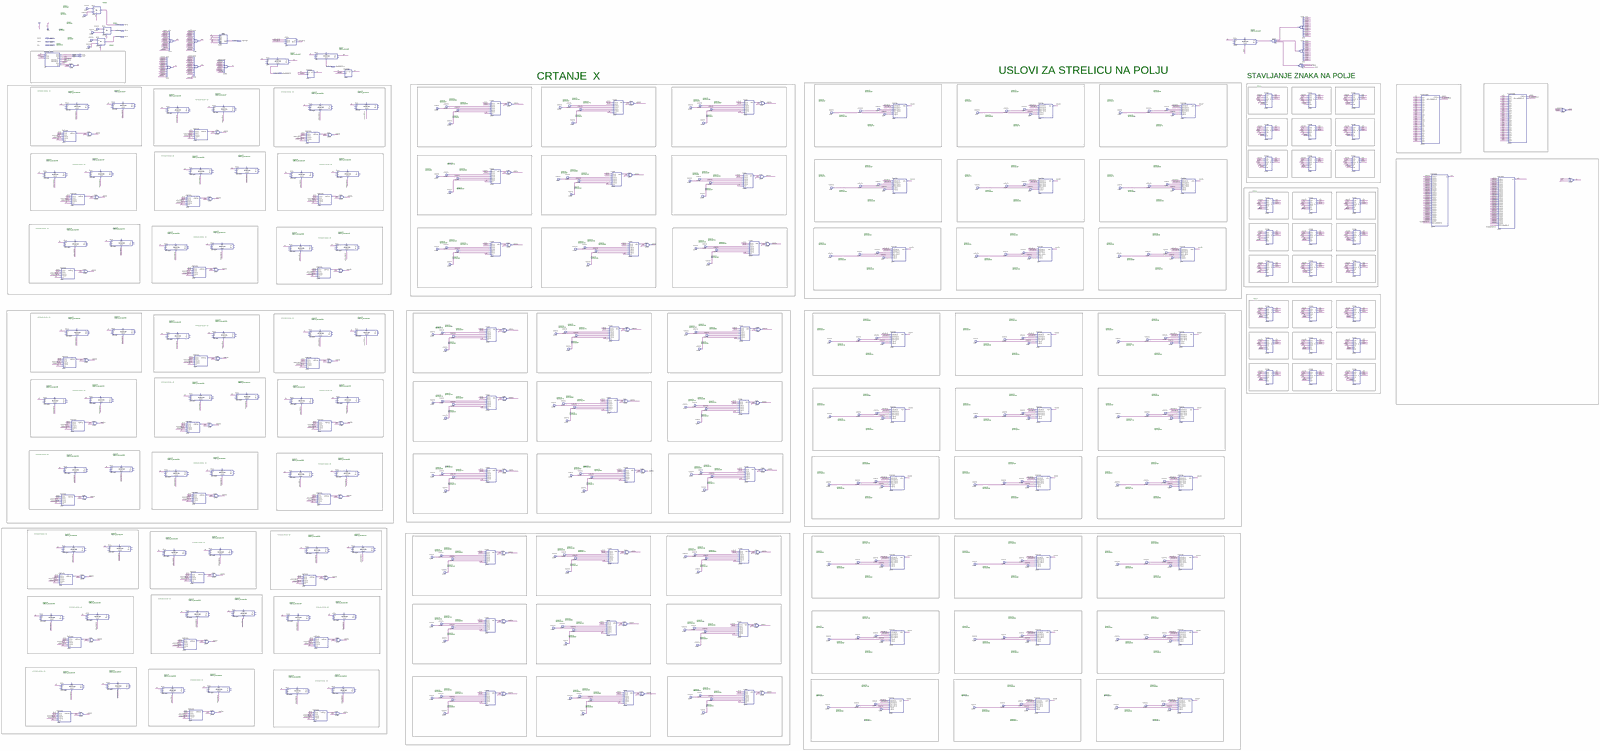
[diagram p0: schematic sheet, whole]
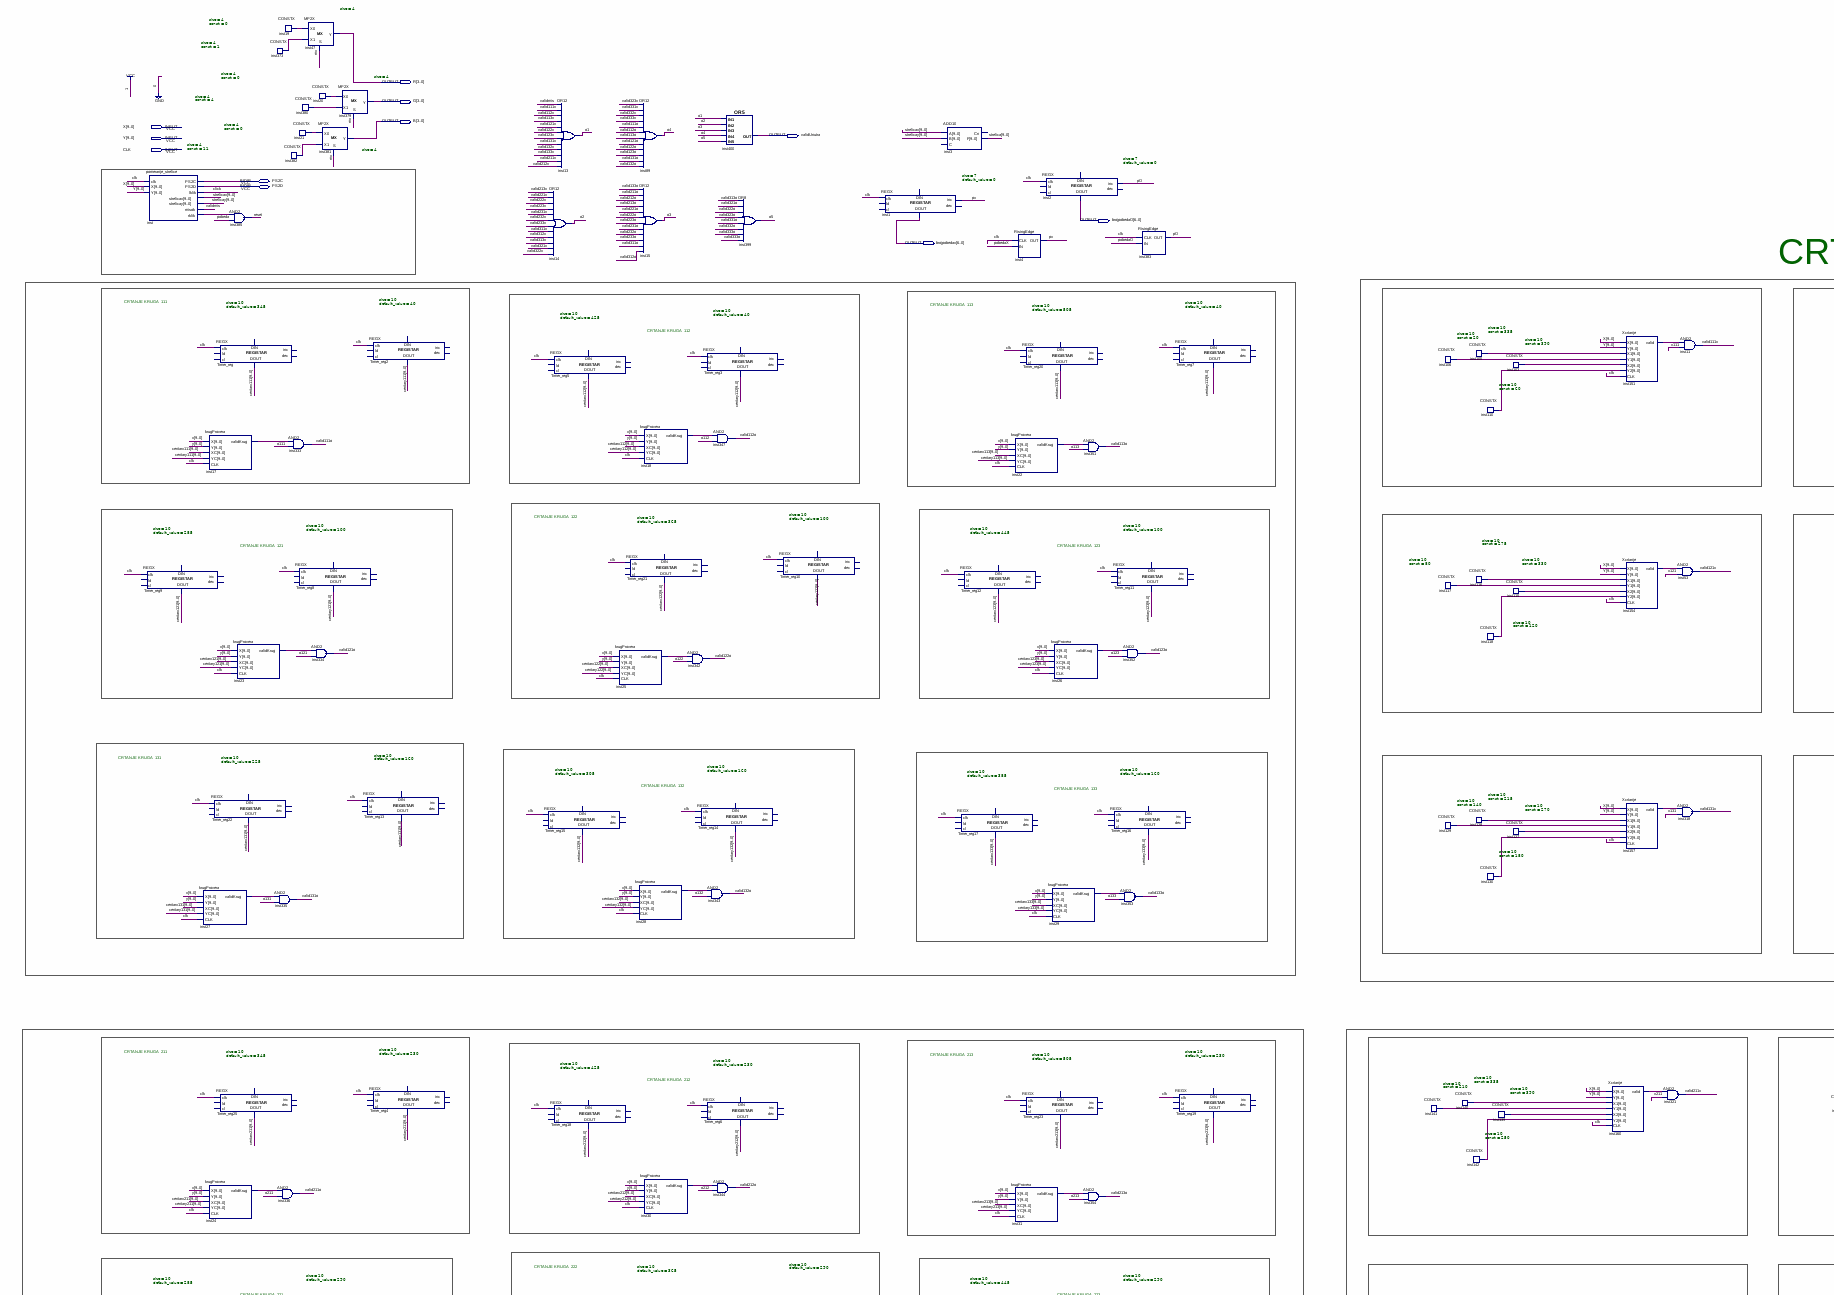
[diagram p1: schematic sheet, upper left part]
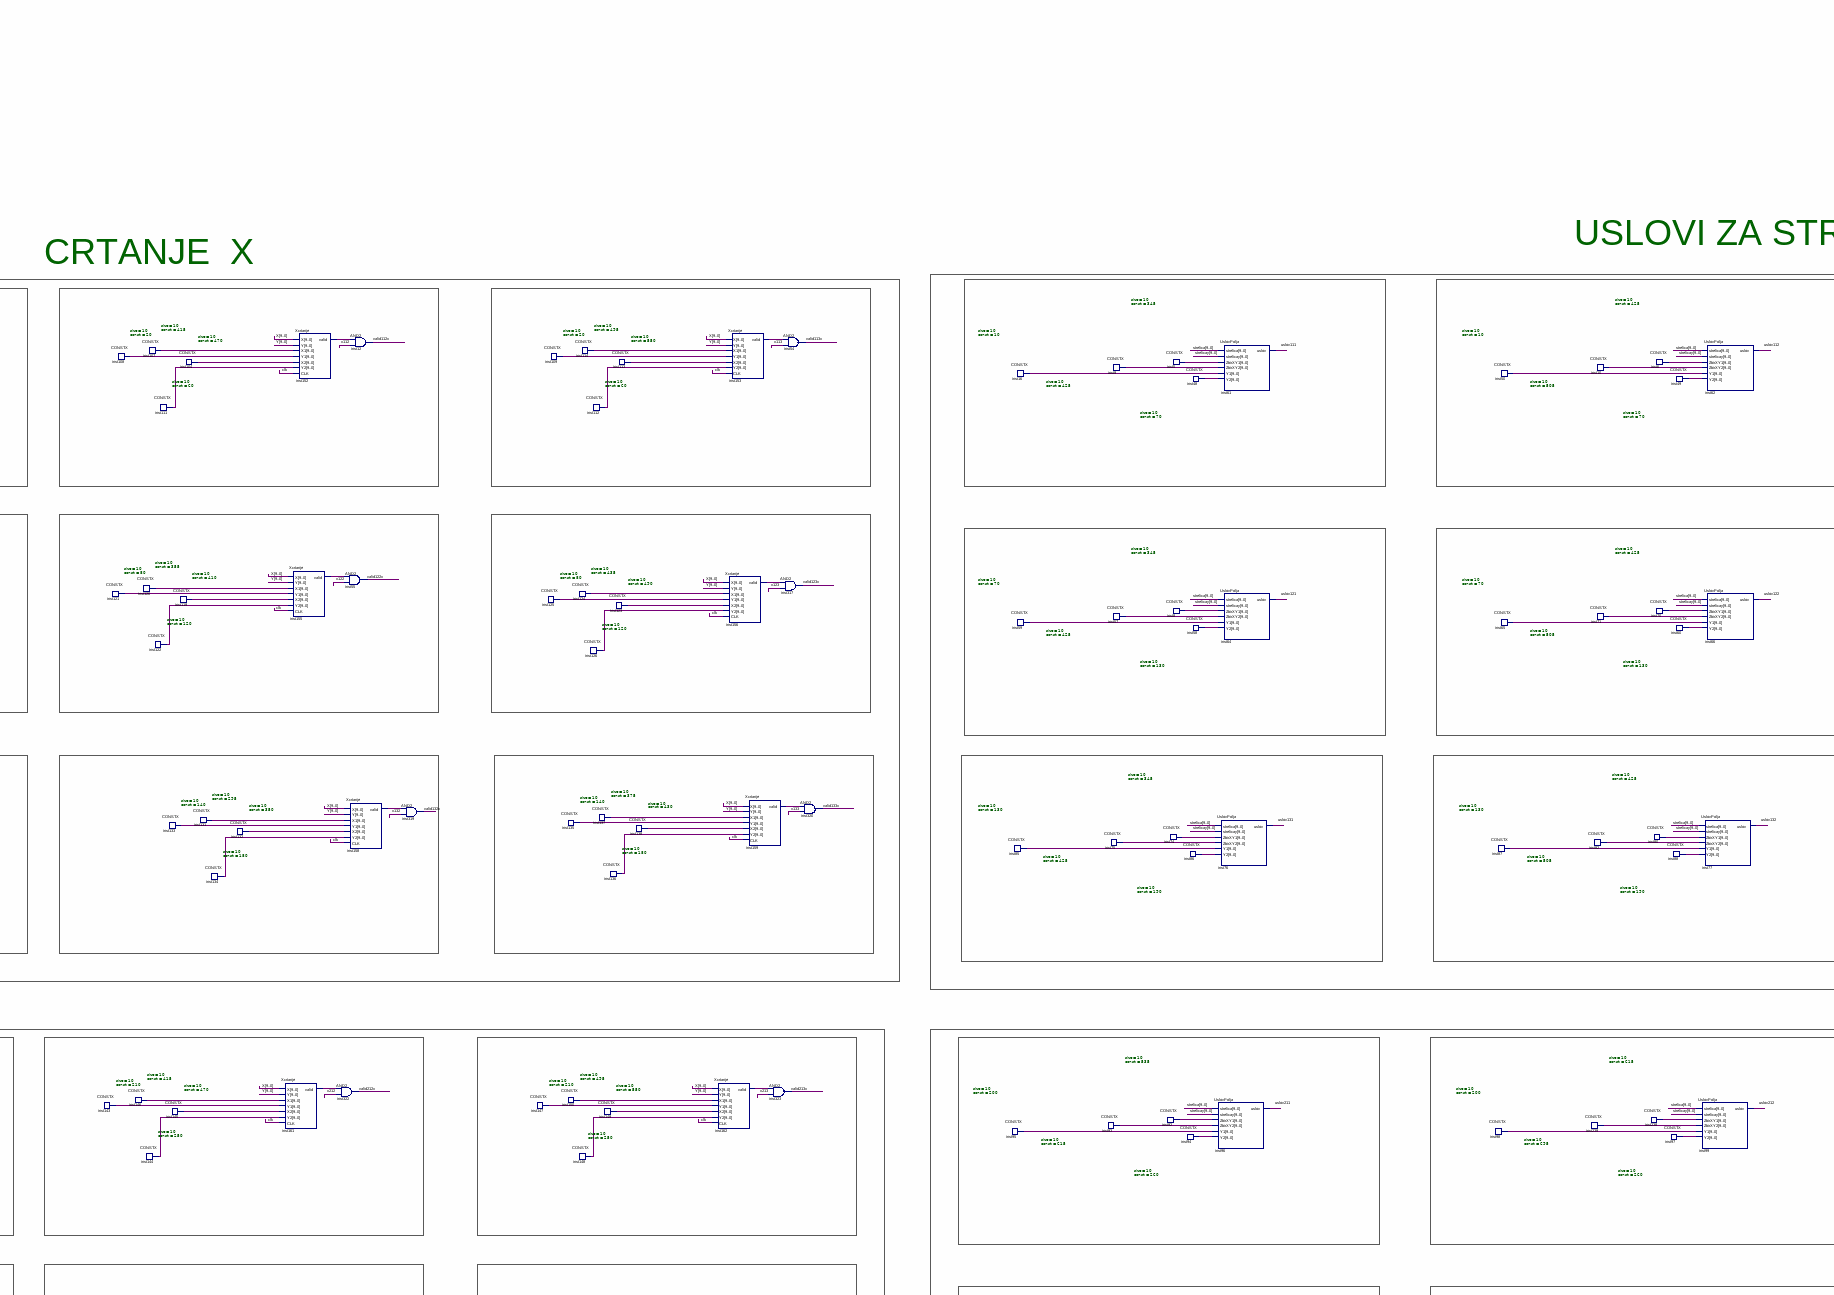
[diagram p2: schematic sheet, upper centre part]
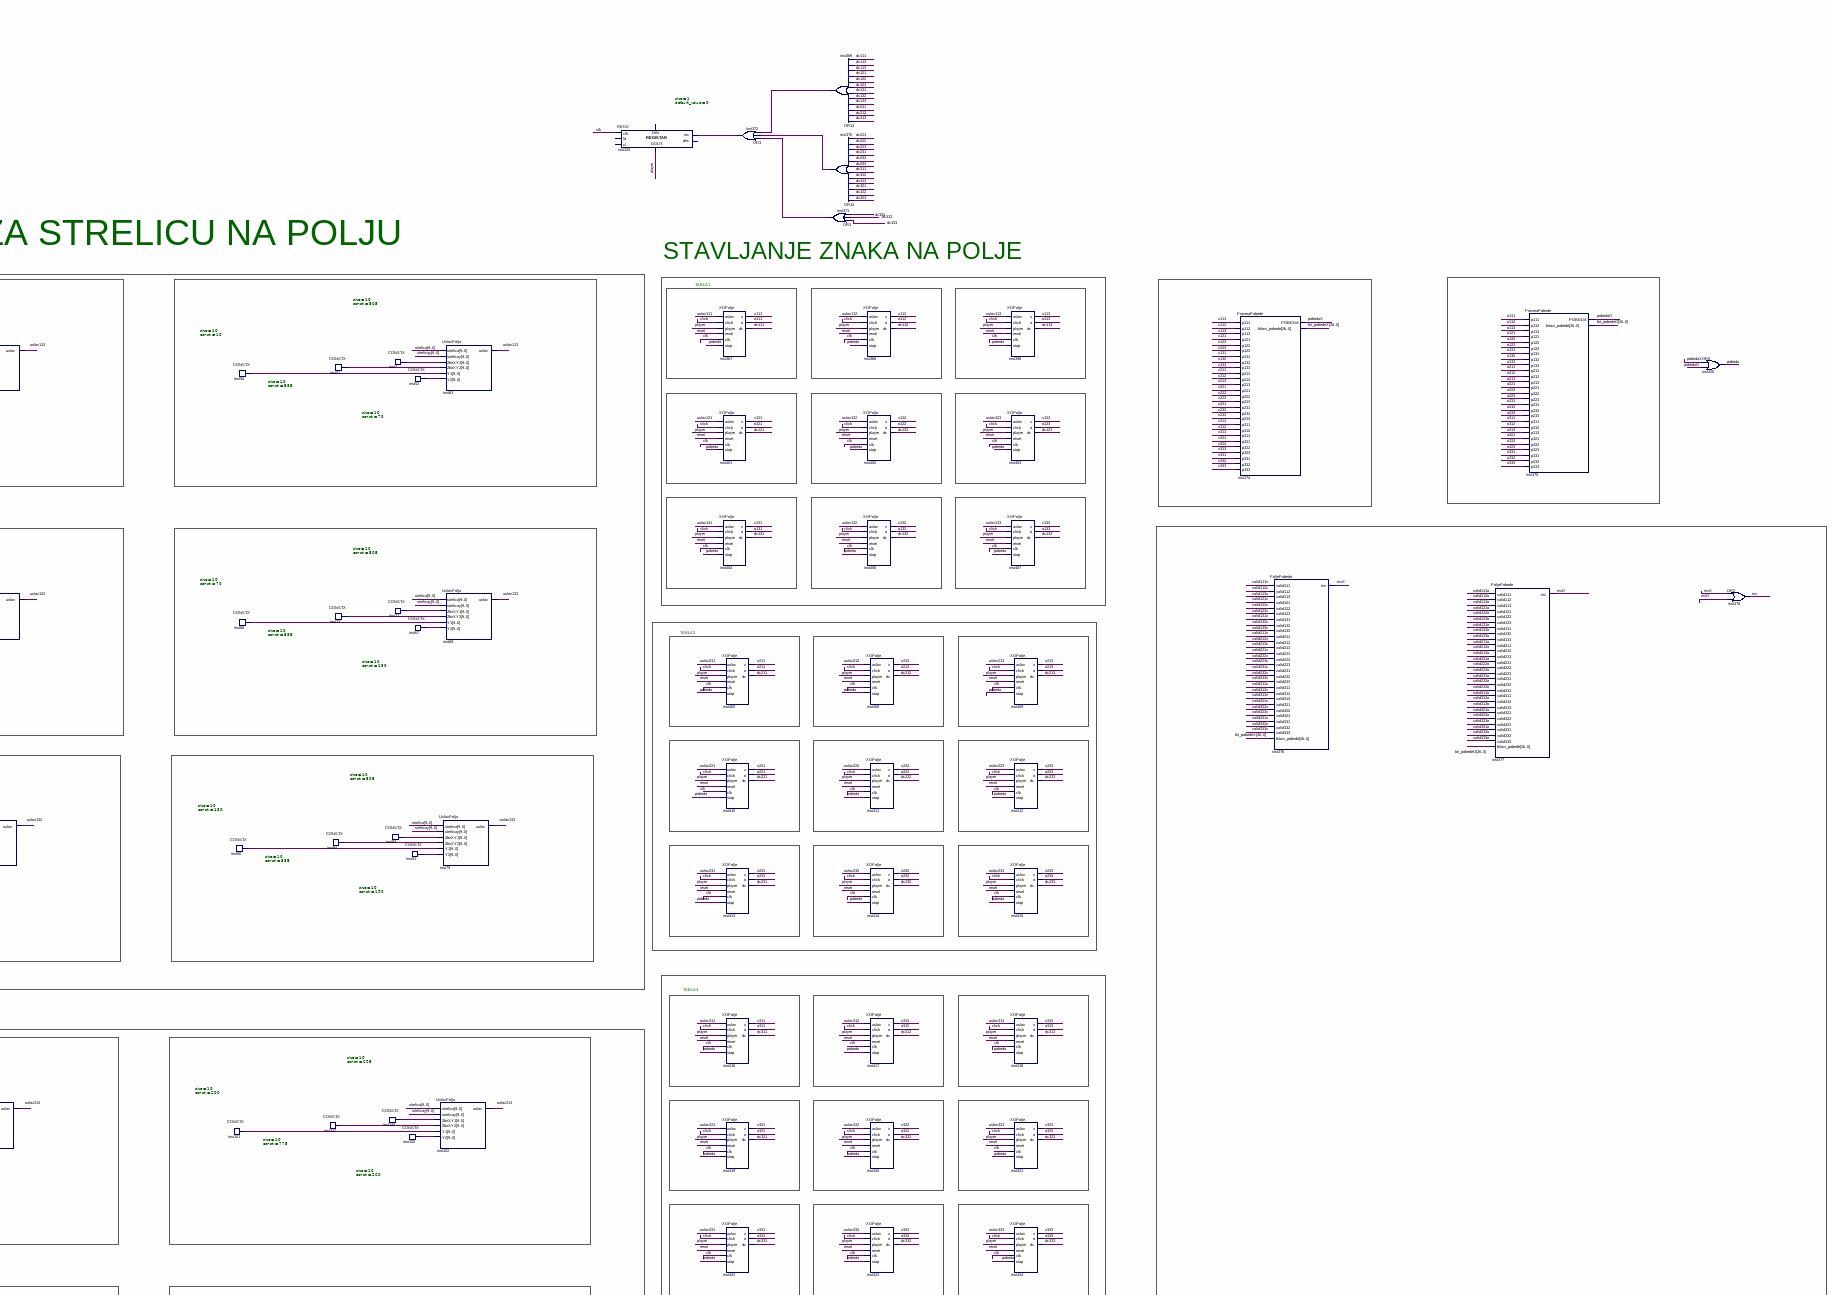
[diagram p3: schematic sheet, upper right part]
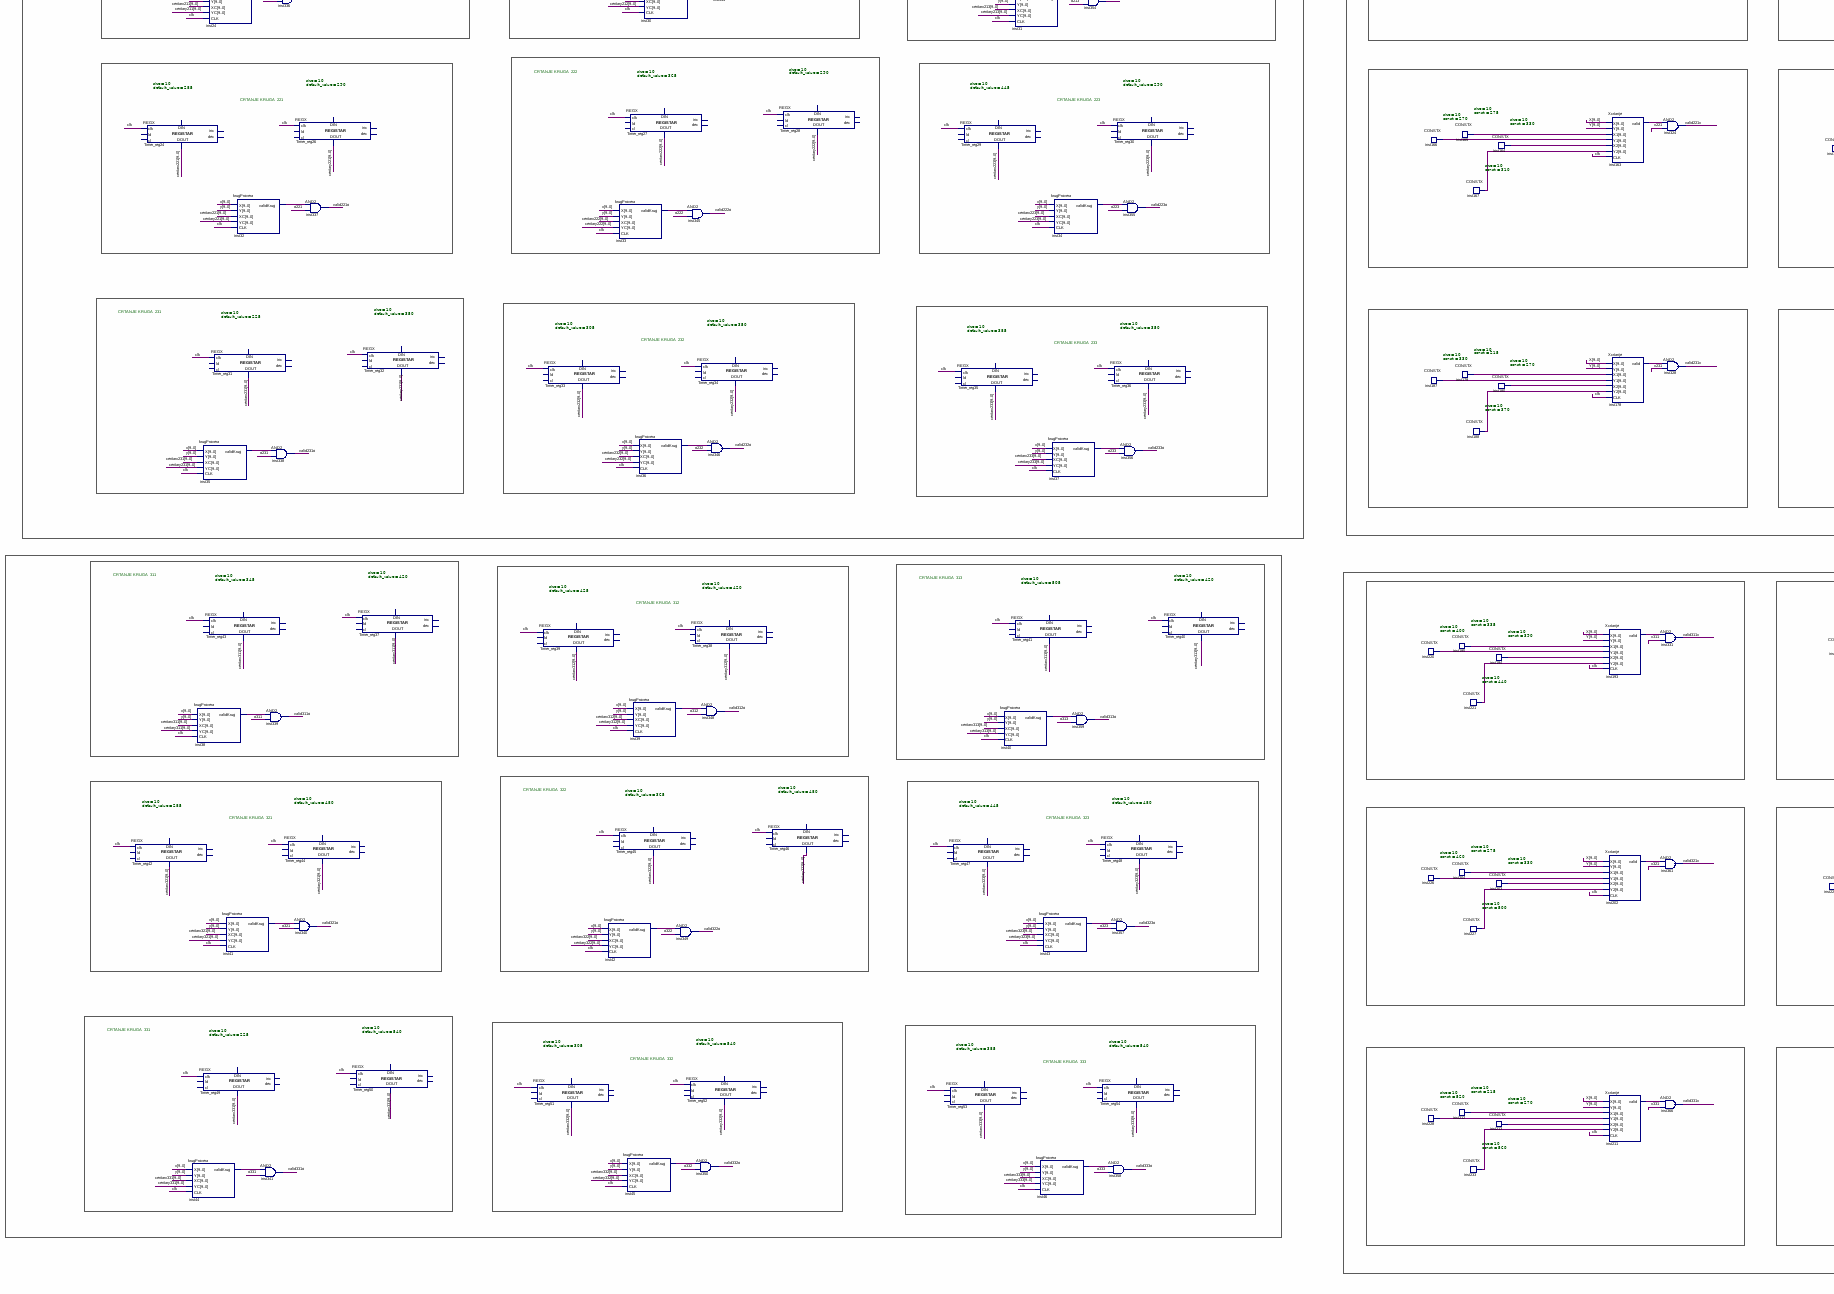
[diagram p4: schematic sheet, lower left part]
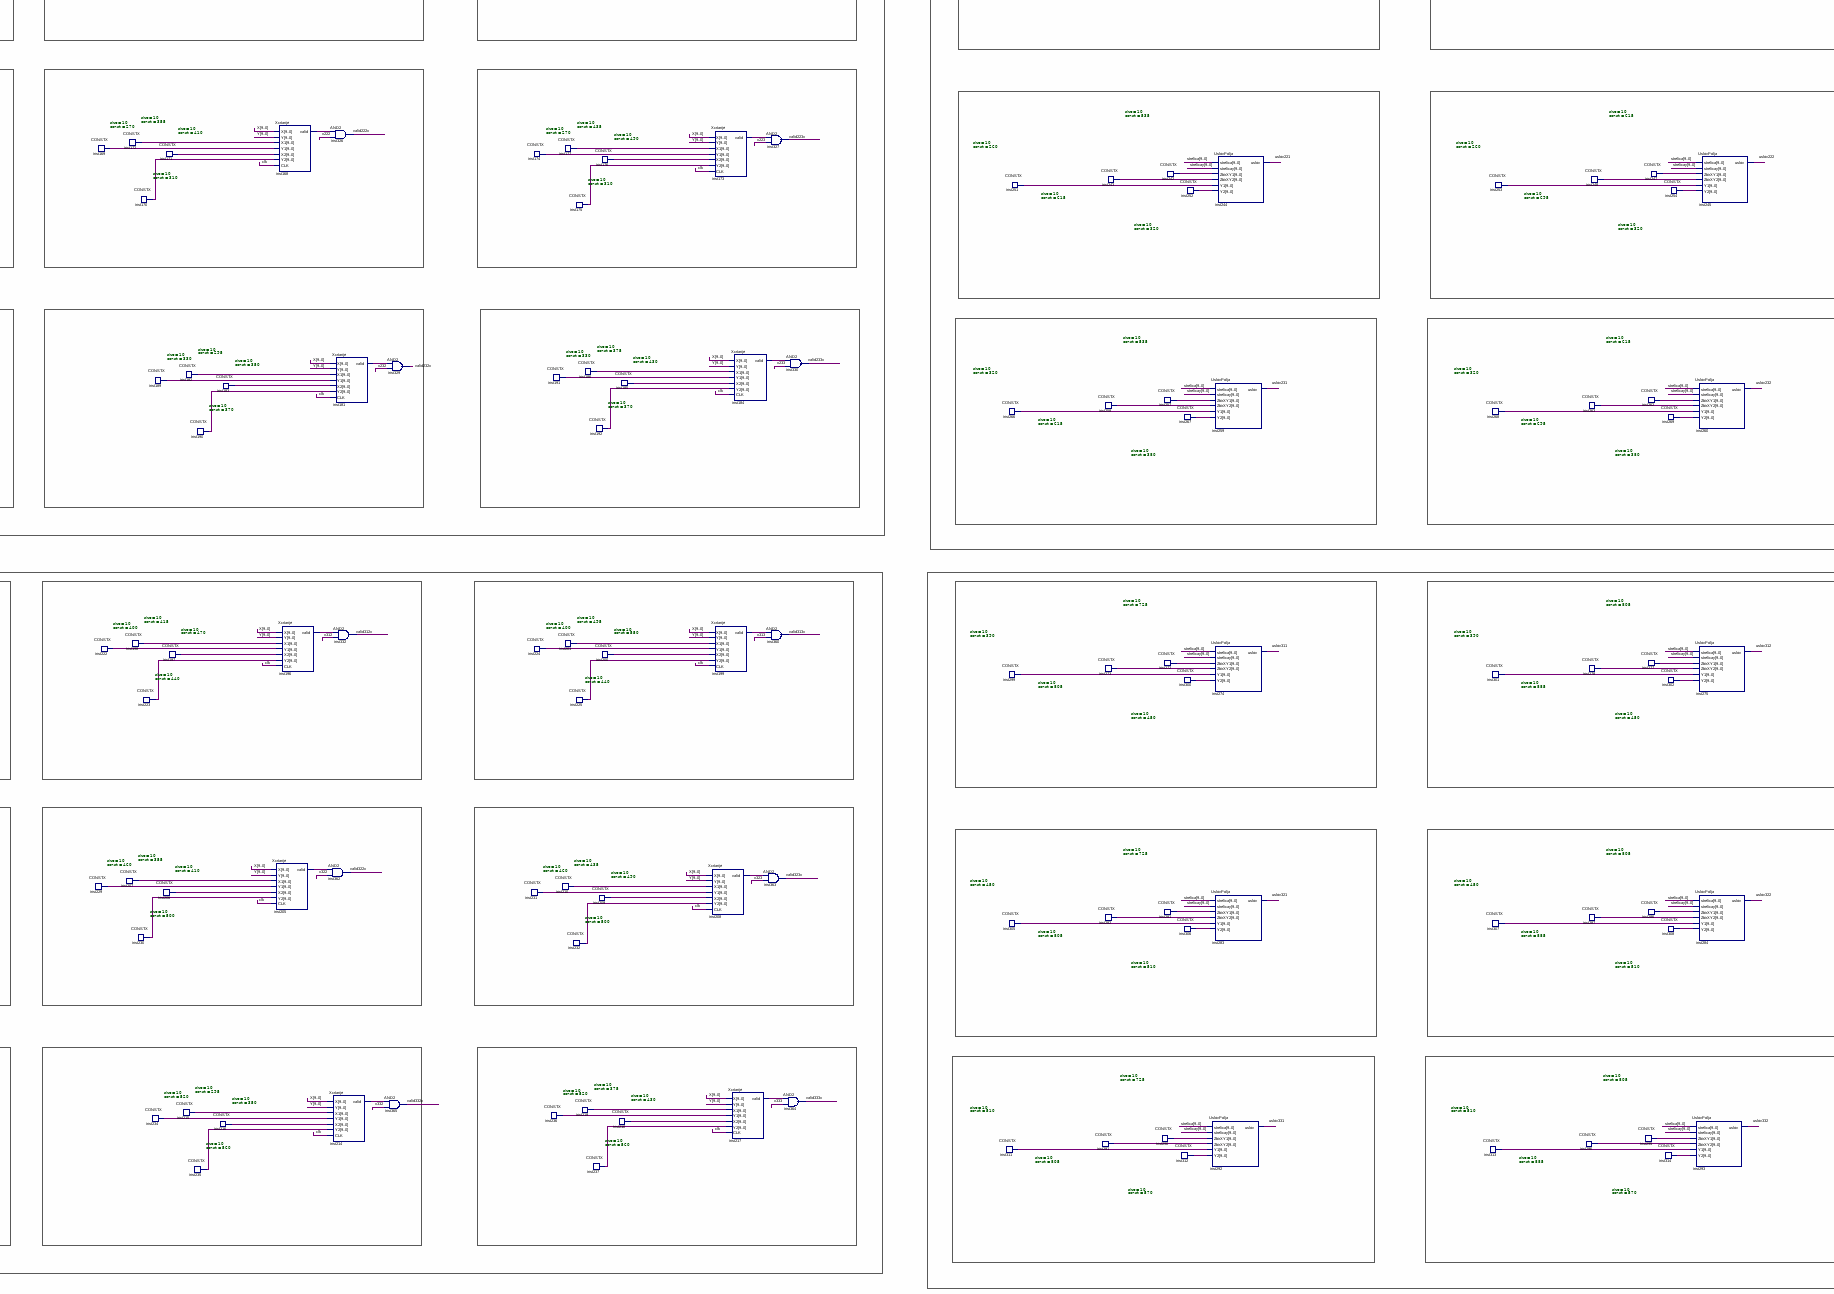
[diagram p5: schematic sheet, lower centre part]
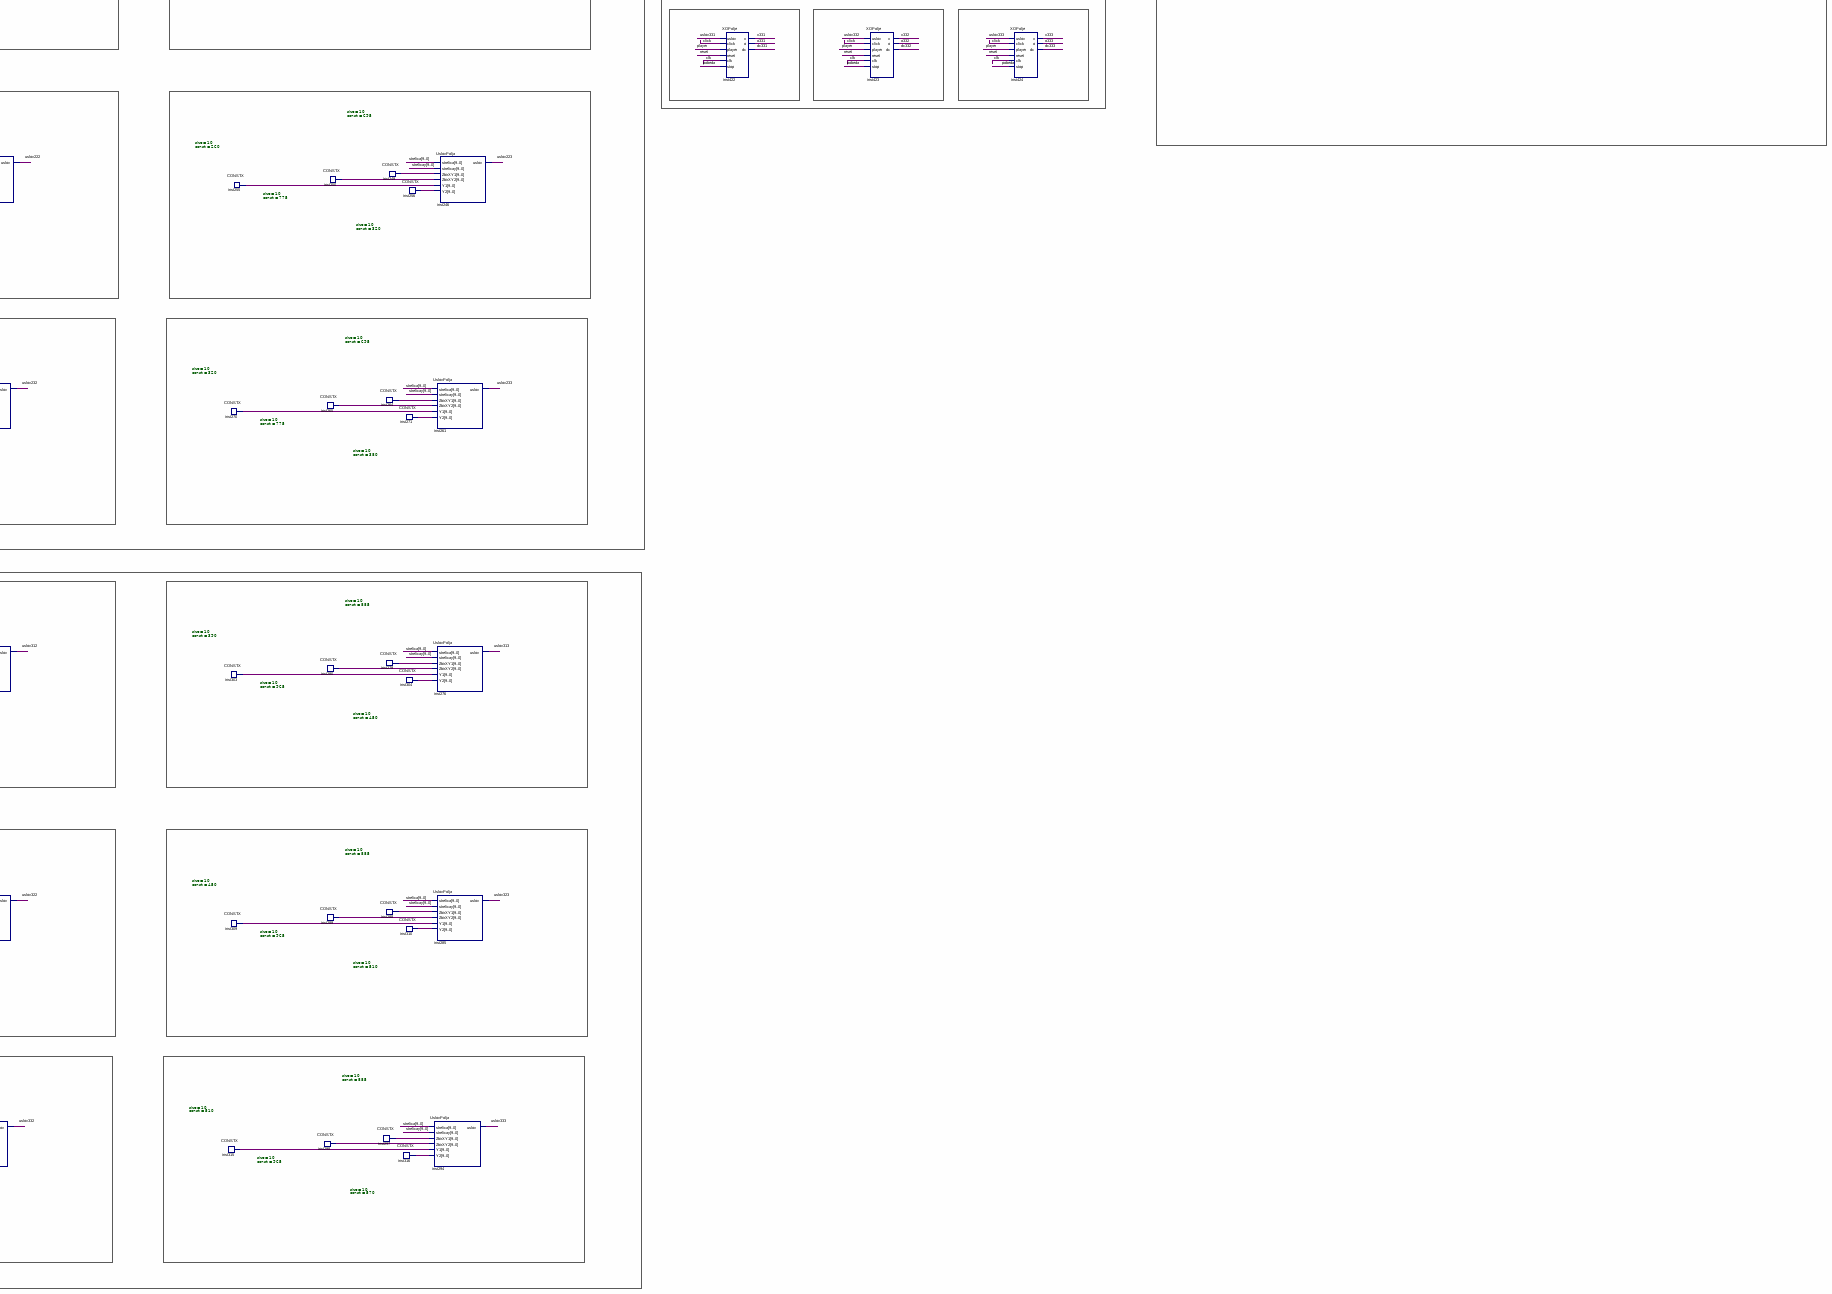
[diagram p6: schematic sheet, lower right part]
// Quartus schematic igra.bdf as structural Verilog: 465 symbols, 11 pins
module igra (
  input  [9:0] X,
  input  [9:0] Y,
  input  CLK,
  inout  PS2C,
  inout  PS2D,
  output [3:0] R,
  output [3:0] G,
  output [3:0] B,
  output validUnutra,
  output [6:0] brojpobedaO,
  output [6:0] brojpobedax
);

  wire click, dc111, dc112, dc113, dc121, dc122, dc123, dc131, dc132, dc133, dc211, dc212, dc213, dc221,
       dc222, dc223, dc231, dc232, dc233, dc311, dc312, dc313, dc321, dc322, dc323, dc331, dc332, dc333,
       inst17_validkrug, inst18_validkrug, inst22_validkrug, inst23_validkrug, inst24_validkrug,
       inst25_validkrug, inst26_validkrug, inst27_validkrug, inst28_validkrug, inst29_validkrug,
       inst30_validkrug, inst31_validkrug, inst32_validkrug, inst33_validkrug, inst34_validkrug,
       inst35_validkrug, inst36_validkrug, inst37_validkrug, inst38_validkrug, inst39_validkrug,
       inst40_validkrug, inst41_validkrug, inst42_validkrug, inst43_validkrug, inst44_validkrug,
       inst45_validkrug, inst46_validkrug, inst151_valid, inst152_valid, inst153_valid, inst154_valid,
       inst155_valid, inst156_valid, inst157_valid, inst158_valid, inst159_valid, inst160_valid,
       inst161_valid, inst162_valid, inst163_valid, inst168_valid, inst173_valid, inst178_valid,
       inst181_valid, inst184_valid, inst193_valid, inst196_valid, inst199_valid, inst202_valid,
       inst205_valid, inst208_valid, inst211_valid, inst214_valid, inst217_valid, inst369_out, inst370_out,
       inst371_out, inst372_out, inst_rklik, mx, mxO, mxX, o1, o2, o3, o4, o5, o111, o112, o113, o121, o122,
       o123, o131, o132, o133, o211, o212, o213, o221, o222, o223, o231, o232, o233, o311, o312, o313, o321,
       o322, o323, o331, o332, o333, player, pO, pobeda, pobedaO, pobedaX, px, reset, uslov111, uslov112,
       uslov113, uslov121, uslov122, uslov123, uslov131, uslov132, uslov133, uslov211, uslov212, uslov213,
       uslov221, uslov222, uslov223, uslov231, uslov232, uslov233, uslov311, uslov312, uslov313, uslov321,
       uslov322, uslov323, uslov331, uslov332, uslov333, valid111o, valid111x, valid112o, valid112x,
       valid113o, valid113x, valid121o, valid121x, valid122o, valid122x, valid123o, valid123x, valid131o,
       valid131x, valid132o, valid132x, valid133o, valid133x, valid211o, valid211x, valid212o, valid212x,
       valid213o, valid213x, valid221o, valid221x, valid222o, valid222x, valid223o, valid223x, valid231o,
       valid231x, valid232o, valid232x, valid233o, valid233x, valid311o, valid311x, valid312o, valid312x,
       valid313o, valid313x, valid321o, valid321x, valid322o, valid322x, valid323o, valid323x, valid331o,
       valid331x, valid332o, valid332x, valid333o, valid333x, validmis, x111, x112, x113, x121, x122, x123,
       x131, x132, x133, x211, x212, x213, x221, x222, x223, x231, x232, x233, x311, x312, x313, x321, x322,
       x323, x331, x332, x333;
  wire [3:0] inst19_data, inst20_data, inst21_data, inst373_data, inst380_data, inst382_data;
  wire [9:0] centarx111, centarx112, centarx113, centarx121, centarx122, centarx123, centarx131, centarx132,
       centarx133, centarx211, centarx212, centarx213, centarx221, centarx222, centarx223, centarx231,
       centarx232, centarx233, centarx311, centarx312, centarx313, centarx321, centarx322, centarx323,
       centarx331, centarx332, centarx333, centary111, centary112, centary113, centary121, centary122,
       centary123, centary131, centary132, centary133, centary211, centary212, centary213, centary221,
       centary222, centary223, centary231, centary232, centary233, centary311, centary312, centary313,
       centary321, centary322, centary323, centary331, centary332, centary333, inst5_data, inst6_data,
       inst7_data, inst8_data, inst9_data, inst10_data, inst16_data, inst48_data, inst49_data, inst50_data,
       inst51_data, inst52_data, inst56_data, inst57_data, inst58_data, inst59_data, inst60_data,
       inst65_data, inst67_data, inst68_data, inst70_data, inst71_data, inst72_data, inst73_data,
       inst74_data, inst75_data, inst80_data, inst82_data, inst83_data, inst84_data, inst85_data,
       inst86_data, inst87_data, inst88_data, inst90_data, inst91_data, inst92_data, inst93_data,
       inst94_data, inst95_data, inst97_data, inst98_data, inst100_data, inst101_data, inst103_data,
       inst104_data, inst105_data, inst106_data, inst107_data, inst108_data, inst109_data, inst110_data,
       inst111_data, inst112_data, inst113_data, inst114_data, inst115_data, inst116_data, inst117_data,
       inst118_data, inst119_data, inst120_data, inst121_data, inst122_data, inst123_data, inst124_data,
       inst125_data, inst126_data, inst127_data, inst128_data, inst129_data, inst130_data, inst131_data,
       inst132_data, inst133_data, inst134_data, inst135_data, inst136_data, inst137_data, inst138_data,
       inst139_data, inst140_data, inst141_data, inst142_data, inst143_data, inst144_data, inst145_data,
       inst146_data, inst147_data, inst148_data, inst149_data, inst150_data, inst164_data, inst165_data,
       inst166_data, inst167_data, inst169_data, inst170_data, inst171_data, inst172_data, inst174_data,
       inst175_data, inst176_data, inst177_data, inst179_data, inst180_data, inst182_data, inst183_data,
       inst185_data, inst186_data, inst187_data, inst188_data, inst189_data, inst190_data, inst191_data,
       inst192_data, inst194_data, inst195_data, inst197_data, inst198_data, inst200_data, inst201_data,
       inst203_data, inst204_data, inst206_data, inst207_data, inst209_data, inst210_data, inst212_data,
       inst213_data, inst215_data, inst216_data, inst218_data, inst219_data, inst220_data, inst221_data,
       inst222_data, inst223_data, inst224_data, inst225_data, inst226_data, inst227_data, inst228_data,
       inst229_data, inst230_data, inst231_data, inst232_data, inst233_data, inst234_data, inst235_data,
       inst236_data, inst237_data, inst238_data, inst239_data, inst240_data, inst241_data, inst242_data,
       inst243_data, inst247_data, inst248_data, inst249_data, inst250_data, inst251_data, inst252_data,
       inst253_data, inst254_data, inst255_data, inst256_data, inst257_data, inst258_data, inst262_data,
       inst263_data, inst264_data, inst265_data, inst266_data, inst267_data, inst268_data, inst269_data,
       inst270_data, inst271_data, inst272_data, inst273_data, inst277_data, inst278_data, inst279_data,
       inst280_data, inst281_data, inst282_data, inst286_data, inst287_data, inst288_data, inst289_data,
       inst290_data, inst291_data, inst295_data, inst296_data, inst297_data, inst298_data, inst299_data,
       inst300_data, inst301_data, inst302_data, inst303_data, inst304_data, inst305_data, inst306_data,
       inst307_data, inst308_data, inst309_data, inst310_data, inst311_data, inst312_data, inst313_data,
       inst314_data, inst315_data, inst316_data, strelica, strelicax, strelicay;
  wire [26:0] bit_pobedeO, bit_pobedeX;

  REGX #(.size(10), .default_value(285)) Timer_reg9 (
    .clk(CLK), .data_out(centarx121));  // open: ld, cl, inc, dec, data_in
  REGX #(.size(10), .default_value(285)) Timer_reg24 (
    .clk(CLK), .data_out(centarx221));  // open: ld, cl, inc, dec, data_in
  REGX #(.size(10), .default_value(285)) Timer_reg42 (
    .clk(CLK), .data_out(centarx321));  // open: ld, cl, inc, dec, data_in
  pomeranje_strelice inst (
    .clk(CLK), .X(X), .Y(Y), .lklik(click), .strelicax(strelicax), .strelicay(strelicay), .misok(validmis),
    .rklik(inst_rklik), .PS2C(PS2C), .PS2D(PS2D));
  krugProvera inst44 (.X(X), .Y(Y), .XC(centarx331), .YC(centary331), .CLK(CLK), .validKrug(inst44_validkrug));
  krugProvera inst17 (.X(X), .Y(Y), .XC(centarx111), .YC(centary111), .CLK(CLK), .validKrug(inst17_validkrug));
  REGX #(.size(10), .default_value(225)) Timer_reg22 (
    .clk(CLK), .data_out(centarx131));  // open: ld, cl, inc, dec, data_in
  krugProvera inst27 (.X(X), .Y(Y), .XC(centarx131), .YC(centary131), .CLK(CLK), .validKrug(inst27_validkrug));
  krugProvera inst24 (.X(X), .Y(Y), .XC(centarx211), .YC(centary211), .CLK(CLK), .validKrug(inst24_validkrug));
  REGX #(.size(10), .default_value(225)) Timer_reg31 (
    .clk(CLK), .data_out(centarx231));  // open: ld, cl, inc, dec, data_in
  krugProvera inst35 (.X(X), .Y(Y), .XC(centarx231), .YC(centary231), .CLK(CLK), .validKrug(inst35_validkrug));
  REGX #(.size(10), .default_value(345)) Timer_reg43 (
    .clk(CLK), .data_out(centarx311));  // open: ld, cl, inc, dec, data_in
  krugProvera inst38 (.X(X), .Y(Y), .XC(centarx311), .YC(centary311), .CLK(CLK), .validKrug(inst38_validkrug));
  REGX #(.size(10), .default_value(225)) Timer_reg49 (
    .clk(CLK), .data_out(centarx331));  // open: ld, cl, inc, dec, data_in
  and inst385 (reset, inst_rklik, pobeda);
  REGX #(.size(10), .default_value(345)) Timer_reg (
    .clk(CLK), .data_out(centarx111));  // open: ld, cl, inc, dec, data_in
  krugProvera inst23 (.X(X), .Y(Y), .XC(centarx121), .YC(centary121), .CLK(CLK), .validKrug(inst23_validkrug));
  REGX #(.size(10), .default_value(345)) Timer_reg25 (
    .clk(CLK), .data_out(centarx211));  // open: ld, cl, inc, dec, data_in
  krugProvera inst32 (.X(X), .Y(Y), .XC(centarx221), .YC(centary221), .CLK(CLK), .validKrug(inst32_validkrug));
  krugProvera inst41 (.X(X), .Y(Y), .XC(centarx321), .YC(centary321), .CLK(CLK), .validKrug(inst41_validkrug));
  CONSTX #(.size(4), .\const (0)) inst19 (.data(inst19_data));
  CONSTX #(.size(4), .\const (1)) inst373 (.data(inst373_data));
  and inst335 (valid131o, inst27_validkrug, o131);
  and inst336 (valid211o, inst24_validkrug, o211);
  and inst338 (valid231o, inst35_validkrug, o231);
  and inst339 (valid311o, inst38_validkrug, o311);
  and inst341 (valid331o, inst44_validkrug, o331);
  CONSTX #(.size(4), .\const (4)) inst380 (.data(inst380_data));
  CONSTX #(.size(4), .\const (0)) inst21 (.data(inst21_data));
  CONSTX #(.size(4), .\const (11)) inst382 (.data(inst382_data));
  and inst333 (valid111o, inst17_validkrug, o111);
  REGX #(.size(10), .default_value(100)) Timer_reg8 (
    .clk(CLK), .data_out(centary121));  // open: ld, cl, inc, dec, data_in
  REGX #(.size(10), .default_value(290)) Timer_reg26 (
    .clk(CLK), .data_out(centary221));  // open: ld, cl, inc, dec, data_in
  REGX #(.size(10), .default_value(480)) Timer_reg44 (
    .clk(CLK), .data_out(centary321));  // open: ld, cl, inc, dec, data_in
  and inst340 (valid321o, inst41_validkrug, o321);
  MP2X #(.size(4)) inst47 (.S(mx), .X0(inst19_data), .X1(inst373_data), .Y(R));
  CONSTX #(.size(4), .\const (0)) inst20 (.data(inst20_data));
  MP2X #(.size(4)) inst381 (.S(mx), .X0(inst21_data), .X1(inst382_data), .Y(B));
  and inst334 (valid121o, inst23_validkrug, o121);
  and inst337 (valid221o, inst32_validkrug, o221);
  MP2X #(.size(4)) inst379 (.S(mx), .X0(inst20_data), .X1(inst380_data), .Y(G));
  REGX #(.size(10), .default_value(40)) Timer_reg2 (
    .clk(CLK), .data_out(centary111));  // open: ld, cl, inc, dec, data_in
  REGX #(.size(10), .default_value(160)) Timer_reg13 (
    .clk(CLK), .data_out(centary131));  // open: ld, cl, inc, dec, data_in
  REGX #(.size(10), .default_value(230)) Timer_reg4 (
    .clk(CLK), .data_out(centary211));  // open: ld, cl, inc, dec, data_in
  REGX #(.size(10), .default_value(350)) Timer_reg32 (
    .clk(CLK), .data_out(centary231));  // open: ld, cl, inc, dec, data_in
  REGX #(.size(10), .default_value(420)) Timer_reg37 (
    .clk(CLK), .data_out(centary311));  // open: ld, cl, inc, dec, data_in
  REGX #(.size(10), .default_value(540)) Timer_reg50 (
    .clk(CLK), .data_out(centary331));  // open: ld, cl, inc, dec, data_in
  or inst14 (o2, valid213x, valid221x, valid222x, valid223x, valid231x, valid232x, valid233x, valid311x, valid312x, valid313x, valid321x, valid322x);
  REGX #(.size(10), .default_value(425)) Timer_reg5 (
    .clk(CLK), .data_out(centarx112));  // open: ld, cl, inc, dec, data_in
  REGX #(.size(10), .default_value(305)) Timer_reg15 (
    .clk(CLK), .data_out(centarx132));  // open: ld, cl, inc, dec, data_in
  REGX #(.size(10), .default_value(425)) Timer_reg18 (
    .clk(CLK), .data_out(centarx212));  // open: ld, cl, inc, dec, data_in
  REGX #(.size(10), .default_value(305)) Timer_reg33 (
    .clk(CLK), .data_out(centarx232));  // open: ld, cl, inc, dec, data_in
  REGX #(.size(10), .default_value(425)) Timer_reg39 (
    .clk(CLK), .data_out(centarx312));  // open: ld, cl, inc, dec, data_in
  REGX #(.size(10), .default_value(305)) Timer_reg51 (
    .clk(CLK), .data_out(centarx332));  // open: ld, cl, inc, dec, data_in
  or inst13 (o1, validmis, valid111x, valid112x, valid113x, valid121x, valid122x, valid123x, valid131x, valid132x, valid133x, valid211x, valid212x);
  krugProvera inst25 (.X(X), .Y(Y), .XC(centarx122), .YC(centary122), .CLK(CLK), .validKrug(inst25_validkrug));
  krugProvera inst33 (.X(X), .Y(Y), .XC(centarx222), .YC(centary222), .CLK(CLK), .validKrug(inst33_validkrug));
  REGX #(.size(10), .default_value(365)) Timer_reg45 (
    .clk(CLK), .data_out(centarx322));  // open: ld, cl, inc, dec, data_in
  krugProvera inst42 (.X(X), .Y(Y), .XC(centarx322), .YC(centary322), .CLK(CLK), .validKrug(inst42_validkrug));
  or inst89 (o4, valid323x, valid331x, valid332x, valid333x, valid111o, valid112o, valid113o, valid121o, valid122o, valid123o, valid131o, valid132o);
  or inst15 (o3, valid133o, valid211o, valid212o, valid213o, valid221o, valid222o, valid223o, valid231o, valid232o, valid233o, valid311o, valid312o);
  krugProvera inst18 (.X(X), .Y(Y), .XC(centarx112), .YC(centary112), .CLK(CLK), .validKrug(inst18_validkrug));
  REGX #(.size(10), .default_value(365)) Timer_reg21 (
    .clk(CLK), .data_out(centarx122));  // open: ld, cl, inc, dec, data_in
  krugProvera inst28 (.X(X), .Y(Y), .XC(centarx132), .YC(centary132), .CLK(CLK), .validKrug(inst28_validkrug));
  krugProvera inst30 (.X(X), .Y(Y), .XC(centarx212), .YC(centary212), .CLK(CLK), .validKrug(inst30_validkrug));
  REGX #(.size(10), .default_value(365)) Timer_reg27 (
    .clk(CLK), .data_out(centarx222));  // open: ld, cl, inc, dec, data_in
  krugProvera inst36 (.X(X), .Y(Y), .XC(centarx232), .YC(centary232), .CLK(CLK), .validKrug(inst36_validkrug));
  krugProvera inst39 (.X(X), .Y(Y), .XC(centarx312), .YC(centary312), .CLK(CLK), .validKrug(inst39_validkrug));
  krugProvera inst45 (.X(X), .Y(Y), .XC(centarx332), .YC(centary332), .CLK(CLK), .validKrug(inst45_validkrug));
  and inst349 (valid322o, inst42_validkrug, o322);
  REGX #(.size(10), .default_value(540)) Timer_reg52 (
    .clk(CLK), .data_out(centary332));  // open: ld, cl, inc, dec, data_in
  REGX #(.size(10), .default_value(40)) Timer_reg3 (
    .clk(CLK), .data_out(centary112));  // open: ld, cl, inc, dec, data_in
  and inst342 (valid122o, inst25_validkrug, o122);
  REGX #(.size(10), .default_value(160)) Timer_reg14 (
    .clk(CLK), .data_out(centary132));  // open: ld, cl, inc, dec, data_in
  and inst343 (valid132o, inst28_validkrug, o132);
  REGX #(.size(10), .default_value(230)) Timer_reg6 (
    .clk(CLK), .data_out(centary212));  // open: ld, cl, inc, dec, data_in
  and inst345 (valid222o, inst33_validkrug, o222);
  REGX #(.size(10), .default_value(350)) Timer_reg34 (
    .clk(CLK), .data_out(centary232));  // open: ld, cl, inc, dec, data_in
  and inst346 (valid232o, inst36_validkrug, o232);
  REGX #(.size(10), .default_value(420)) Timer_reg38 (
    .clk(CLK), .data_out(centary312));  // open: ld, cl, inc, dec, data_in
  and inst348 (valid312o, inst39_validkrug, o312);
  and inst350 (valid332o, inst45_validkrug, o332);
  or inst400 (validUnutra, o1, o2, o3, o4, o5);
  and inst347 (valid112o, inst18_validkrug, o112);
  and inst344 (valid212o, inst30_validkrug, o212);
  or inst399 (o5, valid313o, valid321o, valid322o, valid323o, valid331o, valid332o, valid333o, valid333o);
  REGX #(.size(10), .default_value(480)) Timer_reg46 (
    .clk(CLK), .data_out(centary322));  // open: ld, cl, inc, dec, data_in
  REGX #(.size(10), .default_value(100)) Timer_reg10 (
    .clk(CLK), .data_out(centary122));  // open: ld, cl, inc, dec, data_in
  REGX #(.size(10), .default_value(290)) Timer_reg28 (
    .clk(CLK), .data_out(centary222));  // open: ld, cl, inc, dec, data_in
  REGX #(.size(7), .default_value(0)) inst1 (
    .clk(CLK), .inc(px), .data_out(brojpobedax));  // open: ld, cl, dec, data_in
  ADD10 inst3 (.A(strelicax), .B(strelicay), .F(strelica));  // open: C, Cn
  REGX #(.size(10), .default_value(385)) Timer_reg17 (
    .clk(CLK), .data_out(centarx133));  // open: ld, cl, inc, dec, data_in
  REGX #(.size(10), .default_value(385)) Timer_reg35 (
    .clk(CLK), .data_out(centarx233));  // open: ld, cl, inc, dec, data_in
  REGX #(.size(10), .default_value(445)) Timer_reg47 (
    .clk(CLK), .data_out(centarx323));  // open: ld, cl, inc, dec, data_in
  REGX #(.size(10), .default_value(385)) Timer_reg53 (
    .clk(CLK), .data_out(centarx333));  // open: ld, cl, inc, dec, data_in
  REGX #(.size(10), .default_value(445)) Timer_reg12 (
    .clk(CLK), .data_out(centarx123));  // open: ld, cl, inc, dec, data_in
  REGX #(.size(10), .default_value(445)) Timer_reg29 (
    .clk(CLK), .data_out(centarx223));  // open: ld, cl, inc, dec, data_in
  krugProvera inst40 (.X(X), .Y(Y), .XC(centarx313), .YC(centary313), .CLK(CLK), .validKrug(inst40_validkrug));
  RisingEdge inst4 (.CLK(CLK), .IN(pobedaX), .OUT(px));
  REGX #(.size(10), .default_value(505)) Timer_reg20 (
    .clk(CLK), .data_out(centarx113));  // open: ld, cl, inc, dec, data_in
  krugProvera inst22 (.X(X), .Y(Y), .XC(centarx113), .YC(centary113), .CLK(CLK), .validKrug(inst22_validkrug));
  REGX #(.size(10), .default_value(505)) Timer_reg23 (
    .clk(CLK), .data_out(centarx213));  // open: ld, cl, inc, dec, data_in
  krugProvera inst31 (.X(X), .Y(Y), .XC(centarx213), .YC(centary213), .CLK(CLK), .validKrug(inst31_validkrug));
  REGX #(.size(10), .default_value(505)) Timer_reg41 (
    .clk(CLK), .data_out(centarx313));  // open: ld, cl, inc, dec, data_in
  REGX #(.size(7), .default_value(0)) inst2 (
    .clk(CLK), .inc(pO), .data_out(brojpobedaO));  // open: ld, cl, dec, data_in
  krugProvera inst29 (.X(X), .Y(Y), .XC(centarx133), .YC(centary133), .CLK(CLK), .validKrug(inst29_validkrug));
  krugProvera inst37 (.X(X), .Y(Y), .XC(centarx233), .YC(centary233), .CLK(CLK), .validKrug(inst37_validkrug));
  krugProvera inst43 (.X(X), .Y(Y), .XC(centarx323), .YC(centary323), .CLK(CLK), .validKrug(inst43_validkrug));
  krugProvera inst46 (.X(X), .Y(Y), .XC(centarx333), .YC(centary333), .CLK(CLK), .validKrug(inst46_validkrug));
  krugProvera inst26 (.X(X), .Y(Y), .XC(centarx123), .YC(centary123), .CLK(CLK), .validKrug(inst26_validkrug));
  krugProvera inst34 (.X(X), .Y(Y), .XC(centarx223), .YC(centary223), .CLK(CLK), .validKrug(inst34_validkrug));
  and inst351 (valid113o, inst22_validkrug, o113);
  and inst354 (valid213o, inst31_validkrug, o213);
  and inst359 (valid313o, inst40_validkrug, o313);
  REGX #(.size(10), .default_value(100)) Timer_reg11 (
    .clk(CLK), .data_out(centary123));  // open: ld, cl, inc, dec, data_in
  REGX #(.size(10), .default_value(160)) Timer_reg16 (
    .clk(CLK), .data_out(centary133));  // open: ld, cl, inc, dec, data_in
  REGX #(.size(10), .default_value(290)) Timer_reg30 (
    .clk(CLK), .data_out(centary223));  // open: ld, cl, inc, dec, data_in
  REGX #(.size(10), .default_value(350)) Timer_reg36 (
    .clk(CLK), .data_out(centary233));  // open: ld, cl, inc, dec, data_in
  REGX #(.size(10), .default_value(480)) Timer_reg48 (
    .clk(CLK), .data_out(centary323));  // open: ld, cl, inc, dec, data_in
  and inst357 (valid323o, inst43_validkrug, o323);
  REGX #(.size(10), .default_value(540)) Timer_reg54 (
    .clk(CLK), .data_out(centary333));  // open: ld, cl, inc, dec, data_in
  and inst358 (valid333o, inst46_validkrug, o333);
  RisingEdge inst383 (.CLK(CLK), .IN(pobedaO), .OUT(pO));
  and inst352 (valid123o, inst26_validkrug, o123);
  and inst353 (valid133o, inst29_validkrug, o133);
  and inst355 (valid223o, inst34_validkrug, o223);
  and inst356 (valid233o, inst37_validkrug, o233);
  REGX #(.size(10), .default_value(40)) Timer_reg7 (
    .clk(CLK), .data_out(centary113));  // open: ld, cl, inc, dec, data_in
  REGX #(.size(10), .default_value(230)) Timer_reg19 (
    .clk(CLK), .data_out(centary213));  // open: ld, cl, inc, dec, data_in
  REGX #(.size(10), .default_value(420)) Timer_reg40 (
    .clk(CLK), .data_out(centary313));  // open: ld, cl, inc, dec, data_in
  CONSTX #(.size(10), .\const (210)) inst141 (.data(inst141_data));
  CONSTX #(.size(10), .\const (270)) inst166 (.data(inst166_data));
  CONSTX #(.size(10), .\const (330)) inst187 (.data(inst187_data));
  CONSTX #(.size(10), .\const (400)) inst220 (.data(inst220_data));
  CONSTX #(.size(10), .\const (460)) inst226 (.data(inst226_data));
  CONSTX #(.size(10), .\const (520)) inst228 (.data(inst228_data));
  CONSTX #(.size(10), .\const (20)) inst106 (.data(inst106_data));
  CONSTX #(.size(10), .\const (80)) inst117 (.data(inst117_data));
  CONSTX #(.size(10), .\const (140)) inst129 (.data(inst129_data));
  CONSTX #(.size(10), .\const (335)) inst140 (.data(inst140_data));
  CONSTX #(.size(10), .\const (275)) inst165 (.data(inst165_data));
  CONSTX #(.size(10), .\const (215)) inst179 (.data(inst179_data));
  CONSTX #(.size(10), .\const (335)) inst195 (.data(inst195_data));
  CONSTX #(.size(10), .\const (275)) inst204 (.data(inst204_data));
  CONSTX #(.size(10), .\const (215)) inst212 (.data(inst212_data));
  CONSTX #(.size(10), .\const (335)) inst105 (.data(inst105_data));
  CONSTX #(.size(10), .\const (275)) inst116 (.data(inst116_data));
  CONSTX #(.size(10), .\const (215)) inst128 (.data(inst128_data));
  CONSTX #(.size(10), .\const (250)) inst142 (.data(inst142_data));
  CONSTX #(.size(10), .\const (310)) inst167 (.data(inst167_data));
  CONSTX #(.size(10), .\const (370)) inst188 (.data(inst188_data));
  CONSTX #(.size(10), .\const (440)) inst221 (.data(inst221_data));
  CONSTX #(.size(10), .\const (500)) inst227 (.data(inst227_data));
  CONSTX #(.size(10), .\const (560)) inst233 (.data(inst233_data));
  CONSTX #(.size(10), .\const (60)) inst110 (.data(inst110_data));
  CONSTX #(.size(10), .\const (120)) inst118 (.data(inst118_data));
  CONSTX #(.size(10), .\const (180)) inst130 (.data(inst130_data));
  CONSTX #(.size(10), .\const (390)) inst139 (.data(inst139_data));
  CONSTX #(.size(10), .\const (330)) inst164 (.data(inst164_data));
  CONSTX #(.size(10), .\const (270)) inst180 (.data(inst180_data));
  CONSTX #(.size(10), .\const (390)) inst194 (.data(inst194_data));
  CONSTX #(.size(10), .\const (330)) inst203 (.data(inst203_data));
  CONSTX #(.size(10), .\const (270)) inst213 (.data(inst213_data));
  CONSTX #(.size(10), .\const (390)) inst103 (.data(inst103_data));
  CONSTX #(.size(10), .\const (330)) inst115 (.data(inst115_data));
  CONSTX #(.size(10), .\const (270)) inst127 (.data(inst127_data));
  Xcrtanje inst160 (
    .X(X), .Y(Y), .X1(inst140_data), .Y1(inst141_data), .X2(inst139_data), .Y2(inst142_data), .CLK(CLK),
    .valid(inst160_valid));
  Xcrtanje inst163 (
    .X(X), .Y(Y), .X1(inst165_data), .Y1(inst166_data), .X2(inst164_data), .Y2(inst167_data), .CLK(CLK),
    .valid(inst163_valid));
  Xcrtanje inst178 (
    .X(X), .Y(Y), .X1(inst179_data), .Y1(inst187_data), .X2(inst180_data), .Y2(inst188_data), .CLK(CLK),
    .valid(inst178_valid));
  Xcrtanje inst193 (
    .X(X), .Y(Y), .X1(inst195_data), .Y1(inst220_data), .X2(inst194_data), .Y2(inst221_data), .CLK(CLK),
    .valid(inst193_valid));
  Xcrtanje inst202 (
    .X(X), .Y(Y), .X1(inst204_data), .Y1(inst226_data), .X2(inst203_data), .Y2(inst227_data), .CLK(CLK),
    .valid(inst202_valid));
  Xcrtanje inst211 (
    .X(X), .Y(Y), .X1(inst212_data), .Y1(inst228_data), .X2(inst213_data), .Y2(inst233_data), .CLK(CLK),
    .valid(inst211_valid));
  Xcrtanje inst151 (
    .X(X), .Y(Y), .X1(inst105_data), .Y1(inst106_data), .X2(inst103_data), .Y2(inst110_data), .CLK(CLK),
    .valid(inst151_valid));
  Xcrtanje inst154 (
    .X(X), .Y(Y), .X1(inst116_data), .Y1(inst117_data), .X2(inst115_data), .Y2(inst118_data), .CLK(CLK),
    .valid(inst154_valid));
  Xcrtanje inst157 (
    .X(X), .Y(Y), .X1(inst128_data), .Y1(inst129_data), .X2(inst127_data), .Y2(inst130_data), .CLK(CLK),
    .valid(inst157_valid));
  and inst11 (valid111x, inst151_valid, x111);
  and inst53 (valid121x, inst154_valid, x121);
  and inst318 (valid131x, inst157_valid, x131);
  and inst321 (valid211x, inst160_valid, x211);
  and inst324 (valid221x, inst163_valid, x221);
  and inst328 (valid231x, inst178_valid, x231);
  and inst331 (valid311x, inst193_valid, x311);
  and inst361 (valid321x, inst202_valid, x321);
  and inst366 (valid331x, inst211_valid, x331);
  CONSTX #(.size(10), .\const (80)) inst121 (.data(inst121_data));
  CONSTX #(.size(10), .\const (210)) inst143 (.data(inst143_data));
  CONSTX #(.size(10), .\const (270)) inst169 (.data(inst169_data));
  CONSTX #(.size(10), .\const (400)) inst222 (.data(inst222_data));
  CONSTX #(.size(10), .\const (460)) inst229 (.data(inst229_data));
  CONSTX #(.size(10), .\const (20)) inst108 (.data(inst108_data));
  CONSTX #(.size(10), .\const (415)) inst146 (.data(inst146_data));
  CONSTX #(.size(10), .\const (355)) inst172 (.data(inst172_data));
  CONSTX #(.size(10), .\const (415)) inst198 (.data(inst198_data));
  CONSTX #(.size(10), .\const (355)) inst207 (.data(inst207_data));
  CONSTX #(.size(10), .\const (415)) inst107 (.data(inst107_data));
  CONSTX #(.size(10), .\const (355)) inst120 (.data(inst120_data));
  CONSTX #(.size(10), .\const (120)) inst122 (.data(inst122_data));
  CONSTX #(.size(10), .\const (250)) inst144 (.data(inst144_data));
  CONSTX #(.size(10), .\const (310)) inst170 (.data(inst170_data));
  CONSTX #(.size(10), .\const (330)) inst189 (.data(inst189_data));
  CONSTX #(.size(10), .\const (440)) inst223 (.data(inst223_data));
  CONSTX #(.size(10), .\const (500)) inst230 (.data(inst230_data));
  CONSTX #(.size(10), .\const (520)) inst234 (.data(inst234_data));
  CONSTX #(.size(10), .\const (60)) inst111 (.data(inst111_data));
  CONSTX #(.size(10), .\const (410)) inst119 (.data(inst119_data));
  CONSTX #(.size(10), .\const (140)) inst133 (.data(inst133_data));
  CONSTX #(.size(10), .\const (470)) inst145 (.data(inst145_data));
  CONSTX #(.size(10), .\const (410)) inst171 (.data(inst171_data));
  CONSTX #(.size(10), .\const (470)) inst197 (.data(inst197_data));
  CONSTX #(.size(10), .\const (410)) inst206 (.data(inst206_data));
  CONSTX #(.size(10), .\const (470)) inst104 (.data(inst104_data));
  CONSTX #(.size(10), .\const (295)) inst131 (.data(inst131_data));
  CONSTX #(.size(10), .\const (295)) inst182 (.data(inst182_data));
  CONSTX #(.size(10), .\const (370)) inst190 (.data(inst190_data));
  CONSTX #(.size(10), .\const (295)) inst215 (.data(inst215_data));
  CONSTX #(.size(10), .\const (560)) inst235 (.data(inst235_data));
  CONSTX #(.size(10), .\const (180)) inst134 (.data(inst134_data));
  CONSTX #(.size(10), .\const (350)) inst183 (.data(inst183_data));
  CONSTX #(.size(10), .\const (350)) inst216 (.data(inst216_data));
  CONSTX #(.size(10), .\const (350)) inst132 (.data(inst132_data));
  Xcrtanje inst161 (
    .X(X), .Y(Y), .X1(inst146_data), .Y1(inst143_data), .X2(inst145_data), .Y2(inst144_data), .CLK(CLK),
    .valid(inst161_valid));
  Xcrtanje inst168 (
    .X(X), .Y(Y), .X1(inst172_data), .Y1(inst169_data), .X2(inst171_data), .Y2(inst170_data), .CLK(CLK),
    .valid(inst168_valid));
  Xcrtanje inst196 (
    .X(X), .Y(Y), .X1(inst198_data), .Y1(inst222_data), .X2(inst197_data), .Y2(inst223_data), .CLK(CLK),
    .valid(inst196_valid));
  Xcrtanje inst205 (
    .X(X), .Y(Y), .X1(inst207_data), .Y1(inst229_data), .X2(inst206_data), .Y2(inst230_data), .CLK(CLK),
    .valid(inst205_valid));
  Xcrtanje inst152 (
    .X(X), .Y(Y), .X1(inst107_data), .Y1(inst108_data), .X2(inst104_data), .Y2(inst111_data), .CLK(CLK),
    .valid(inst152_valid));
  Xcrtanje inst155 (
    .X(X), .Y(Y), .X1(inst120_data), .Y1(inst121_data), .X2(inst119_data), .Y2(inst122_data), .CLK(CLK),
    .valid(inst155_valid));
  and inst326 (valid222x, inst168_valid, x222);
  Xcrtanje inst181 (
    .X(X), .Y(Y), .X1(inst182_data), .Y1(inst189_data), .X2(inst183_data), .Y2(inst190_data), .CLK(CLK),
    .valid(inst181_valid));
  and inst362 (valid322x, inst205_valid, x322);
  Xcrtanje inst214 (
    .X(X), .Y(Y), .X1(inst215_data), .Y1(inst234_data), .X2(inst216_data), .Y2(inst235_data), .CLK(CLK),
    .valid(inst214_valid));
  and inst12 (valid112x, inst152_valid, x112);
  and inst55 (valid122x, inst155_valid, x122);
  Xcrtanje inst158 (
    .X(X), .Y(Y), .X1(inst131_data), .Y1(inst133_data), .X2(inst132_data), .Y2(inst134_data), .CLK(CLK),
    .valid(inst158_valid));
  and inst322 (valid212x, inst161_valid, x212);
  and inst332 (valid312x, inst196_valid, x312);
  and inst329 (valid232x, inst181_valid, x232);
  and inst365 (valid332x, inst214_valid, x332);
  and inst319 (valid132x, inst158_valid, x132);
  CONSTX #(.size(10), .\const (210)) inst147 (.data(inst147_data));
  CONSTX #(.size(10), .\const (270)) inst174 (.data(inst174_data));
  CONSTX #(.size(10), .\const (400)) inst224 (.data(inst224_data));
  CONSTX #(.size(10), .\const (460)) inst231 (.data(inst231_data));
  CONSTX #(.size(10), .\const (20)) inst109 (.data(inst109_data));
  CONSTX #(.size(10), .\const (80)) inst125 (.data(inst125_data));
  CONSTX #(.size(10), .\const (435)) inst177 (.data(inst177_data));
  CONSTX #(.size(10), .\const (330)) inst191 (.data(inst191_data));
  CONSTX #(.size(10), .\const (495)) inst201 (.data(inst201_data));
  CONSTX #(.size(10), .\const (435)) inst210 (.data(inst210_data));
  CONSTX #(.size(10), .\const (520)) inst236 (.data(inst236_data));
  CONSTX #(.size(10), .\const (495)) inst114 (.data(inst114_data));
  CONSTX #(.size(10), .\const (435)) inst124 (.data(inst124_data));
  CONSTX #(.size(10), .\const (140)) inst135 (.data(inst135_data));
  CONSTX #(.size(10), .\const (495)) inst150 (.data(inst150_data));
  CONSTX #(.size(10), .\const (250)) inst148 (.data(inst148_data));
  CONSTX #(.size(10), .\const (310)) inst175 (.data(inst175_data));
  CONSTX #(.size(10), .\const (375)) inst186 (.data(inst186_data));
  CONSTX #(.size(10), .\const (440)) inst225 (.data(inst225_data));
  CONSTX #(.size(10), .\const (500)) inst232 (.data(inst232_data));
  CONSTX #(.size(10), .\const (375)) inst219 (.data(inst219_data));
  CONSTX #(.size(10), .\const (60)) inst112 (.data(inst112_data));
  CONSTX #(.size(10), .\const (120)) inst126 (.data(inst126_data));
  CONSTX #(.size(10), .\const (375)) inst137 (.data(inst137_data));
  CONSTX #(.size(10), .\const (180)) inst136 (.data(inst136_data));
  CONSTX #(.size(10), .\const (550)) inst149 (.data(inst149_data));
  CONSTX #(.size(10), .\const (490)) inst176 (.data(inst176_data));
  CONSTX #(.size(10), .\const (370)) inst192 (.data(inst192_data));
  CONSTX #(.size(10), .\const (550)) inst200 (.data(inst200_data));
  CONSTX #(.size(10), .\const (490)) inst209 (.data(inst209_data));
  CONSTX #(.size(10), .\const (560)) inst237 (.data(inst237_data));
  CONSTX #(.size(10), .\const (550)) inst113 (.data(inst113_data));
  CONSTX #(.size(10), .\const (490)) inst123 (.data(inst123_data));
  CONSTX #(.size(10), .\const (430)) inst185 (.data(inst185_data));
  CONSTX #(.size(10), .\const (430)) inst218 (.data(inst218_data));
  CONSTX #(.size(10), .\const (430)) inst138 (.data(inst138_data));
  Xcrtanje inst162 (
    .X(X), .Y(Y), .X1(inst150_data), .Y1(inst147_data), .X2(inst149_data), .Y2(inst148_data), .CLK(CLK),
    .valid(inst162_valid));
  Xcrtanje inst173 (
    .X(X), .Y(Y), .X1(inst177_data), .Y1(inst174_data), .X2(inst176_data), .Y2(inst175_data), .CLK(CLK),
    .valid(inst173_valid));
  Xcrtanje inst199 (
    .X(X), .Y(Y), .X1(inst201_data), .Y1(inst224_data), .X2(inst200_data), .Y2(inst225_data), .CLK(CLK),
    .valid(inst199_valid));
  Xcrtanje inst208 (
    .X(X), .Y(Y), .X1(inst210_data), .Y1(inst231_data), .X2(inst209_data), .Y2(inst232_data), .CLK(CLK),
    .valid(inst208_valid));
  Xcrtanje inst153 (
    .X(X), .Y(Y), .X1(inst114_data), .Y1(inst109_data), .X2(inst113_data), .Y2(inst112_data), .CLK(CLK),
    .valid(inst153_valid));
  Xcrtanje inst156 (
    .X(X), .Y(Y), .X1(inst124_data), .Y1(inst125_data), .X2(inst123_data), .Y2(inst126_data), .CLK(CLK),
    .valid(inst156_valid));
  Xcrtanje inst184 (
    .X(X), .Y(Y), .X1(inst186_data), .Y1(inst191_data), .X2(inst185_data), .Y2(inst192_data), .CLK(CLK),
    .valid(inst184_valid));
  Xcrtanje inst217 (
    .X(X), .Y(Y), .X1(inst219_data), .Y1(inst236_data), .X2(inst218_data), .Y2(inst237_data), .CLK(CLK),
    .valid(inst217_valid));
  Xcrtanje inst159 (
    .X(X), .Y(Y), .X1(inst137_data), .Y1(inst135_data), .X2(inst138_data), .Y2(inst136_data), .CLK(CLK),
    .valid(inst159_valid));
  and inst54 (valid113x, inst153_valid, x113);
  and inst317 (valid123x, inst156_valid, x123);
  and inst323 (valid213x, inst162_valid, x213);
  and inst327 (valid223x, inst173_valid, x223);
  and inst360 (valid313x, inst199_valid, x313);
  and inst363 (valid323x, inst208_valid, x323);
  and inst364 (valid333x, inst217_valid, x333);
  and inst320 (valid133x, inst159_valid, x133);
  and inst330 (valid233x, inst184_valid, x233);
  CONSTX #(.size(10), .\const (10)) inst16 (.data(inst16_data));
  CONSTX #(.size(10), .\const (70)) inst59 (.data(inst59_data));
  CONSTX #(.size(10), .\const (130)) inst85 (.data(inst85_data));
  CONSTX #(.size(10), .\const (200)) inst95 (.data(inst95_data));
  CONSTX #(.size(10), .\const (260)) inst251 (.data(inst251_data));
  CONSTX #(.size(10), .\const (320)) inst266 (.data(inst266_data));
  CONSTX #(.size(10), .\const (390)) inst299 (.data(inst299_data));
  CONSTX #(.size(10), .\const (450)) inst305 (.data(inst305_data));
  CONSTX #(.size(10), .\const (510)) inst311 (.data(inst311_data));
  CONSTX #(.size(10), .\const (615)) inst93 (.data(inst93_data));
  CONSTX #(.size(10), .\const (615)) inst243 (.data(inst243_data));
  CONSTX #(.size(10), .\const (615)) inst258 (.data(inst258_data));
  CONSTX #(.size(10), .\const (805)) inst273 (.data(inst273_data));
  CONSTX #(.size(10), .\const (805)) inst282 (.data(inst282_data));
  CONSTX #(.size(10), .\const (805)) inst291 (.data(inst291_data));
  CONSTX #(.size(10), .\const (425)) inst9 (.data(inst9_data));
  CONSTX #(.size(10), .\const (425)) inst57 (.data(inst57_data));
  CONSTX #(.size(10), .\const (425)) inst75 (.data(inst75_data));
  CONSTX #(.size(10), .\const (345)) inst5 (.data(inst5_data));
  CONSTX #(.size(10), .\const (345)) inst8 (.data(inst8_data));
  CONSTX #(.size(10), .\const (345)) inst74 (.data(inst74_data));
  CONSTX #(.size(10), .\const (535)) inst92 (.data(inst92_data));
  CONSTX #(.size(10), .\const (535)) inst242 (.data(inst242_data));
  CONSTX #(.size(10), .\const (535)) inst257 (.data(inst257_data));
  CONSTX #(.size(10), .\const (725)) inst272 (.data(inst272_data));
  CONSTX #(.size(10), .\const (725)) inst281 (.data(inst281_data));
  CONSTX #(.size(10), .\const (725)) inst290 (.data(inst290_data));
  CONSTX #(.size(10), .\const (70)) inst48 (.data(inst48_data));
  CONSTX #(.size(10), .\const (130)) inst58 (.data(inst58_data));
  CONSTX #(.size(10), .\const (190)) inst86 (.data(inst86_data));
  CONSTX #(.size(10), .\const (260)) inst94 (.data(inst94_data));
  CONSTX #(.size(10), .\const (320)) inst252 (.data(inst252_data));
  CONSTX #(.size(10), .\const (380)) inst267 (.data(inst267_data));
  CONSTX #(.size(10), .\const (450)) inst300 (.data(inst300_data));
  CONSTX #(.size(10), .\const (510)) inst306 (.data(inst306_data));
  CONSTX #(.size(10), .\const (570)) inst312 (.data(inst312_data));
  UslovPolja inst96 (
    .strelica(strelica), .strelicay(strelicay), .ZbirXY1(inst92_data), .ZbirXY2(inst93_data),
    .Y1(inst95_data), .Y2(inst94_data), .uslov(uslov211));
  UslovPolja inst244 (
    .strelica(strelica), .strelicay(strelicay), .ZbirXY1(inst242_data), .ZbirXY2(inst243_data),
    .Y1(inst251_data), .Y2(inst252_data), .uslov(uslov221));
  UslovPolja inst259 (
    .strelica(strelica), .strelicay(strelicay), .ZbirXY1(inst257_data), .ZbirXY2(inst258_data),
    .Y1(inst266_data), .Y2(inst267_data), .uslov(uslov231));
  UslovPolja inst274 (
    .strelica(strelica), .strelicay(strelicay), .ZbirXY1(inst272_data), .ZbirXY2(inst273_data),
    .Y1(inst299_data), .Y2(inst300_data), .uslov(uslov311));
  UslovPolja inst283 (
    .strelica(strelica), .strelicay(strelicay), .ZbirXY1(inst281_data), .ZbirXY2(inst282_data),
    .Y1(inst305_data), .Y2(inst306_data), .uslov(uslov321));
  UslovPolja inst292 (
    .strelica(strelica), .strelicay(strelicay), .ZbirXY1(inst290_data), .ZbirXY2(inst291_data),
    .Y1(inst311_data), .Y2(inst312_data), .uslov(uslov331));
  UslovPolja inst61 (
    .strelica(strelica), .strelicay(strelicay), .ZbirXY1(inst5_data), .ZbirXY2(inst9_data), .Y1(inst16_data),
    .Y2(inst48_data), .uslov(uslov111));
  UslovPolja inst64 (
    .strelica(strelica), .strelicay(strelicay), .ZbirXY1(inst8_data), .ZbirXY2(inst57_data),
    .Y1(inst59_data), .Y2(inst58_data), .uslov(uslov121));
  UslovPolja inst76 (
    .strelica(strelica), .strelicay(strelicay), .ZbirXY1(inst74_data), .ZbirXY2(inst75_data),
    .Y1(inst85_data), .Y2(inst86_data), .uslov(uslov131));
  CONSTX #(.size(10), .\const (320)) inst268 (.data(inst268_data));
  CONSTX #(.size(10), .\const (390)) inst301 (.data(inst301_data));
  CONSTX #(.size(10), .\const (450)) inst307 (.data(inst307_data));
  CONSTX #(.size(10), .\const (510)) inst313 (.data(inst313_data));
  CONSTX #(.size(10), .\const (10)) inst50 (.data(inst50_data));
  CONSTX #(.size(10), .\const (70)) inst65 (.data(inst65_data));
  CONSTX #(.size(10), .\const (130)) inst87 (.data(inst87_data));
  CONSTX #(.size(10), .\const (200)) inst98 (.data(inst98_data));
  CONSTX #(.size(10), .\const (260)) inst253 (.data(inst253_data));
  CONSTX #(.size(10), .\const (505)) inst10 (.data(inst10_data));
  CONSTX #(.size(10), .\const (505)) inst71 (.data(inst71_data));
  CONSTX #(.size(10), .\const (505)) inst82 (.data(inst82_data));
  CONSTX #(.size(10), .\const (695)) inst239 (.data(inst239_data));
  CONSTX #(.size(10), .\const (695)) inst248 (.data(inst248_data));
  CONSTX #(.size(10), .\const (695)) inst263 (.data(inst263_data));
  CONSTX #(.size(10), .\const (885)) inst278 (.data(inst278_data));
  CONSTX #(.size(10), .\const (885)) inst287 (.data(inst287_data));
  CONSTX #(.size(10), .\const (885)) inst296 (.data(inst296_data));
  CONSTX #(.size(10), .\const (615)) inst238 (.data(inst238_data));
  CONSTX #(.size(10), .\const (615)) inst247 (.data(inst247_data));
  CONSTX #(.size(10), .\const (615)) inst262 (.data(inst262_data));
  CONSTX #(.size(10), .\const (805)) inst277 (.data(inst277_data));
  CONSTX #(.size(10), .\const (805)) inst286 (.data(inst286_data));
  CONSTX #(.size(10), .\const (805)) inst295 (.data(inst295_data));
  CONSTX #(.size(10), .\const (425)) inst6 (.data(inst6_data));
  CONSTX #(.size(10), .\const (425)) inst70 (.data(inst70_data));
  CONSTX #(.size(10), .\const (425)) inst80 (.data(inst80_data));
  CONSTX #(.size(10), .\const (190)) inst88 (.data(inst88_data));
  CONSTX #(.size(10), .\const (260)) inst97 (.data(inst97_data));
  CONSTX #(.size(10), .\const (320)) inst254 (.data(inst254_data));
  CONSTX #(.size(10), .\const (380)) inst269 (.data(inst269_data));
  CONSTX #(.size(10), .\const (450)) inst302 (.data(inst302_data));
  CONSTX #(.size(10), .\const (510)) inst308 (.data(inst308_data));
  CONSTX #(.size(10), .\const (570)) inst314 (.data(inst314_data));
  CONSTX #(.size(10), .\const (70)) inst49 (.data(inst49_data));
  CONSTX #(.size(10), .\const (130)) inst60 (.data(inst60_data));
  UslovPolja inst62 (
    .strelica(strelica), .strelicay(strelicay), .ZbirXY1(inst6_data), .ZbirXY2(inst10_data),
    .Y1(inst50_data), .Y2(inst49_data), .uslov(uslov112));
  UslovPolja inst66 (
    .strelica(strelica), .strelicay(strelicay), .ZbirXY1(inst70_data), .ZbirXY2(inst71_data),
    .Y1(inst65_data), .Y2(inst60_data), .uslov(uslov122));
  UslovPolja inst77 (
    .strelica(strelica), .strelicay(strelicay), .ZbirXY1(inst80_data), .ZbirXY2(inst82_data),
    .Y1(inst87_data), .Y2(inst88_data), .uslov(uslov132));
  UslovPolja inst99 (
    .strelica(strelica), .strelicay(strelicay), .ZbirXY1(inst238_data), .ZbirXY2(inst239_data),
    .Y1(inst98_data), .Y2(inst97_data), .uslov(uslov212));
  UslovPolja inst245 (
    .strelica(strelica), .strelicay(strelicay), .ZbirXY1(inst247_data), .ZbirXY2(inst248_data),
    .Y1(inst253_data), .Y2(inst254_data), .uslov(uslov222));
  UslovPolja inst260 (
    .strelica(strelica), .strelicay(strelicay), .ZbirXY1(inst262_data), .ZbirXY2(inst263_data),
    .Y1(inst268_data), .Y2(inst269_data), .uslov(uslov232));
  UslovPolja inst275 (
    .strelica(strelica), .strelicay(strelicay), .ZbirXY1(inst277_data), .ZbirXY2(inst278_data),
    .Y1(inst301_data), .Y2(inst302_data), .uslov(uslov312));
  UslovPolja inst284 (
    .strelica(strelica), .strelicay(strelicay), .ZbirXY1(inst286_data), .ZbirXY2(inst287_data),
    .Y1(inst307_data), .Y2(inst308_data), .uslov(uslov322));
  UslovPolja inst293 (
    .strelica(strelica), .strelicay(strelicay), .ZbirXY1(inst295_data), .ZbirXY2(inst296_data),
    .Y1(inst313_data), .Y2(inst314_data), .uslov(uslov332));
  CONSTX #(.size(10), .\const (200)) inst101 (.data(inst101_data));
  CONSTX #(.size(10), .\const (260)) inst255 (.data(inst255_data));
  CONSTX #(.size(10), .\const (320)) inst270 (.data(inst270_data));
  CONSTX #(.size(10), .\const (390)) inst303 (.data(inst303_data));
  CONSTX #(.size(10), .\const (450)) inst309 (.data(inst309_data));
  CONSTX #(.size(10), .\const (510)) inst315 (.data(inst315_data));
  CONSTX #(.size(10), .\const (10)) inst56 (.data(inst56_data));
  CONSTX #(.size(10), .\const (70)) inst68 (.data(inst68_data));
  CONSTX #(.size(10), .\const (130)) inst90 (.data(inst90_data));
  CONSTX #(.size(10), .\const (965)) inst298 (.data(inst298_data));
  CONSTX #(.size(10), .\const (585)) inst51 (.data(inst51_data));
  CONSTX #(.size(10), .\const (585)) inst73 (.data(inst73_data));
  CONSTX #(.size(10), .\const (585)) inst84 (.data(inst84_data));
  CONSTX #(.size(10), .\const (775)) inst241 (.data(inst241_data));
  CONSTX #(.size(10), .\const (775)) inst250 (.data(inst250_data));
  CONSTX #(.size(10), .\const (775)) inst265 (.data(inst265_data));
  CONSTX #(.size(10), .\const (965)) inst280 (.data(inst280_data));
  CONSTX #(.size(10), .\const (965)) inst289 (.data(inst289_data));
  CONSTX #(.size(10), .\const (505)) inst83 (.data(inst83_data));
  CONSTX #(.size(10), .\const (695)) inst240 (.data(inst240_data));
  CONSTX #(.size(10), .\const (695)) inst249 (.data(inst249_data));
  CONSTX #(.size(10), .\const (695)) inst264 (.data(inst264_data));
  CONSTX #(.size(10), .\const (885)) inst279 (.data(inst279_data));
  CONSTX #(.size(10), .\const (885)) inst288 (.data(inst288_data));
  CONSTX #(.size(10), .\const (885)) inst297 (.data(inst297_data));
  CONSTX #(.size(10), .\const (505)) inst7 (.data(inst7_data));
  CONSTX #(.size(10), .\const (70)) inst52 (.data(inst52_data));
  CONSTX #(.size(10), .\const (505)) inst72 (.data(inst72_data));
  CONSTX #(.size(10), .\const (130)) inst67 (.data(inst67_data));
  CONSTX #(.size(10), .\const (190)) inst91 (.data(inst91_data));
  CONSTX #(.size(10), .\const (260)) inst100 (.data(inst100_data));
  CONSTX #(.size(10), .\const (320)) inst256 (.data(inst256_data));
  CONSTX #(.size(10), .\const (380)) inst271 (.data(inst271_data));
  CONSTX #(.size(10), .\const (450)) inst304 (.data(inst304_data));
  CONSTX #(.size(10), .\const (510)) inst310 (.data(inst310_data));
  CONSTX #(.size(10), .\const (570)) inst316 (.data(inst316_data));
  UslovPolja inst294 (
    .strelica(strelica), .strelicay(strelicay), .ZbirXY1(inst297_data), .ZbirXY2(inst298_data),
    .Y1(inst315_data), .Y2(inst316_data), .uslov(uslov333));
  UslovPolja inst63 (
    .strelica(strelica), .strelicay(strelicay), .ZbirXY1(inst7_data), .ZbirXY2(inst51_data),
    .Y1(inst56_data), .Y2(inst52_data), .uslov(uslov113));
  UslovPolja inst69 (
    .strelica(strelica), .strelicay(strelicay), .ZbirXY1(inst72_data), .ZbirXY2(inst73_data),
    .Y1(inst68_data), .Y2(inst67_data), .uslov(uslov123));
  UslovPolja inst79 (
    .strelica(strelica), .strelicay(strelicay), .ZbirXY1(inst83_data), .ZbirXY2(inst84_data),
    .Y1(inst90_data), .Y2(inst91_data), .uslov(uslov133));
  UslovPolja inst102 (
    .strelica(strelica), .strelicay(strelicay), .ZbirXY1(inst240_data), .ZbirXY2(inst241_data),
    .Y1(inst101_data), .Y2(inst100_data), .uslov(uslov213));
  UslovPolja inst246 (
    .strelica(strelica), .strelicay(strelicay), .ZbirXY1(inst249_data), .ZbirXY2(inst250_data),
    .Y1(inst255_data), .Y2(inst256_data), .uslov(uslov223));
  UslovPolja inst261 (
    .strelica(strelica), .strelicay(strelicay), .ZbirXY1(inst264_data), .ZbirXY2(inst265_data),
    .Y1(inst270_data), .Y2(inst271_data), .uslov(uslov233));
  UslovPolja inst276 (
    .strelica(strelica), .strelicay(strelicay), .ZbirXY1(inst279_data), .ZbirXY2(inst280_data),
    .Y1(inst303_data), .Y2(inst304_data), .uslov(uslov313));
  UslovPolja inst285 (
    .strelica(strelica), .strelicay(strelicay), .ZbirXY1(inst288_data), .ZbirXY2(inst289_data),
    .Y1(inst309_data), .Y2(inst310_data), .uslov(uslov323));
  REGX #(.size(1), .default_value(0)) inst325 (
    .clk(CLK), .inc(inst372_out), .data_out(player));  // open: ld, cl, dec, data_in
  XOPolje inst367 (
    .uslov(uslov111), .click(click), .player(player), .reset(reset), .clk(CLK), .stop(pobeda), .x(x111),
    .o(o111), .dc(dc111));
  XOPolje inst401 (
    .uslov(uslov121), .click(click), .player(player), .reset(reset), .clk(CLK), .stop(pobeda), .x(x121),
    .o(o121), .dc(dc121));
  XOPolje inst404 (
    .uslov(uslov131), .click(click), .player(player), .reset(reset), .clk(CLK), .stop(pobeda), .x(x131),
    .o(o131), .dc(dc131));
  XOPolje inst405 (
    .uslov(uslov211), .click(click), .player(player), .reset(reset), .clk(CLK), .stop(pobeda), .x(x211),
    .o(o211), .dc(dc211));
  XOPolje inst410 (
    .uslov(uslov221), .click(click), .player(player), .reset(reset), .clk(CLK), .stop(pobeda), .x(x221),
    .o(o221), .dc(dc221));
  XOPolje inst413 (
    .uslov(uslov231), .click(click), .player(player), .reset(reset), .clk(CLK), .stop(pobeda), .x(x231),
    .o(o231), .dc(dc231));
  XOPolje inst416 (
    .uslov(uslov311), .click(click), .player(player), .reset(reset), .clk(CLK), .stop(pobeda), .x(x311),
    .o(o311), .dc(dc311));
  XOPolje inst419 (
    .uslov(uslov321), .click(click), .player(player), .reset(reset), .clk(CLK), .stop(pobeda), .x(x321),
    .o(o321), .dc(dc321));
  XOPolje inst422 (
    .uslov(uslov331), .click(click), .player(player), .reset(reset), .clk(CLK), .stop(pobeda), .x(x331),
    .o(o331), .dc(dc331));
  or inst372 (inst372_out, inst371_out, inst370_out, inst369_out);
  or inst369 (inst369_out, dc213, dc212, dc211, dc133, dc132, dc131, dc123, dc122, dc121, dc113, dc112, dc111);
  or inst370 (inst370_out, dc323, dc322, dc321, dc313, dc312, dc311, dc233, dc232, dc231, dc223, dc222, dc221);
  or inst371 (inst371_out, dc333, dc332, dc331);
  XOPolje inst368 (
    .uslov(uslov112), .click(click), .player(player), .reset(reset), .clk(CLK), .stop(pobeda), .x(x112),
    .o(o112), .dc(dc112));
  XOPolje inst402 (
    .uslov(uslov122), .click(click), .player(player), .reset(reset), .clk(CLK), .stop(pobeda), .x(x122),
    .o(o122), .dc(dc122));
  XOPolje inst406 (
    .uslov(uslov132), .click(click), .player(player), .reset(reset), .clk(CLK), .stop(pobeda), .x(x132),
    .o(o132), .dc(dc132));
  XOPolje inst408 (
    .uslov(uslov212), .click(click), .player(player), .reset(reset), .clk(CLK), .stop(pobeda), .x(x212),
    .o(o212), .dc(dc212));
  XOPolje inst411 (
    .uslov(uslov222), .click(click), .player(player), .reset(reset), .clk(CLK), .stop(pobeda), .x(x222),
    .o(o222), .dc(dc222));
  XOPolje inst414 (
    .uslov(uslov232), .click(click), .player(player), .reset(reset), .clk(CLK), .stop(pobeda), .x(x232),
    .o(o232), .dc(dc232));
  XOPolje inst417 (
    .uslov(uslov312), .click(click), .player(player), .reset(reset), .clk(CLK), .stop(pobeda), .x(x312),
    .o(o312), .dc(dc312));
  XOPolje inst420 (
    .uslov(uslov322), .click(click), .player(player), .reset(reset), .clk(CLK), .stop(pobeda), .x(x322),
    .o(o322), .dc(dc322));
  XOPolje inst423 (
    .uslov(uslov332), .click(click), .player(player), .reset(reset), .clk(CLK), .stop(pobeda), .x(x332),
    .o(o332), .dc(dc332));
  XOPolje inst398 (
    .uslov(uslov113), .click(click), .player(player), .reset(reset), .clk(CLK), .stop(pobeda), .x(x113),
    .o(o113), .dc(dc113));
  XOPolje inst403 (
    .uslov(uslov123), .click(click), .player(player), .reset(reset), .clk(CLK), .stop(pobeda), .x(x123),
    .o(o123), .dc(dc123));
  XOPolje inst407 (
    .uslov(uslov133), .click(click), .player(player), .reset(reset), .clk(CLK), .stop(pobeda), .x(x133),
    .o(o133), .dc(dc133));
  XOPolje inst409 (
    .uslov(uslov213), .click(click), .player(player), .reset(reset), .clk(CLK), .stop(pobeda), .x(x213),
    .o(o213), .dc(dc213));
  XOPolje inst412 (
    .uslov(uslov223), .click(click), .player(player), .reset(reset), .clk(CLK), .stop(pobeda), .x(x223),
    .o(o223), .dc(dc223));
